# Altium project Artix Express UltraScale v2_2023-02-28T07_25_07_UTC.PrjPcb (part 5 of 7)

## Sheet FPGA Power.SchDoc
size A3; SheetNumber: 3; SheetTotal: 16
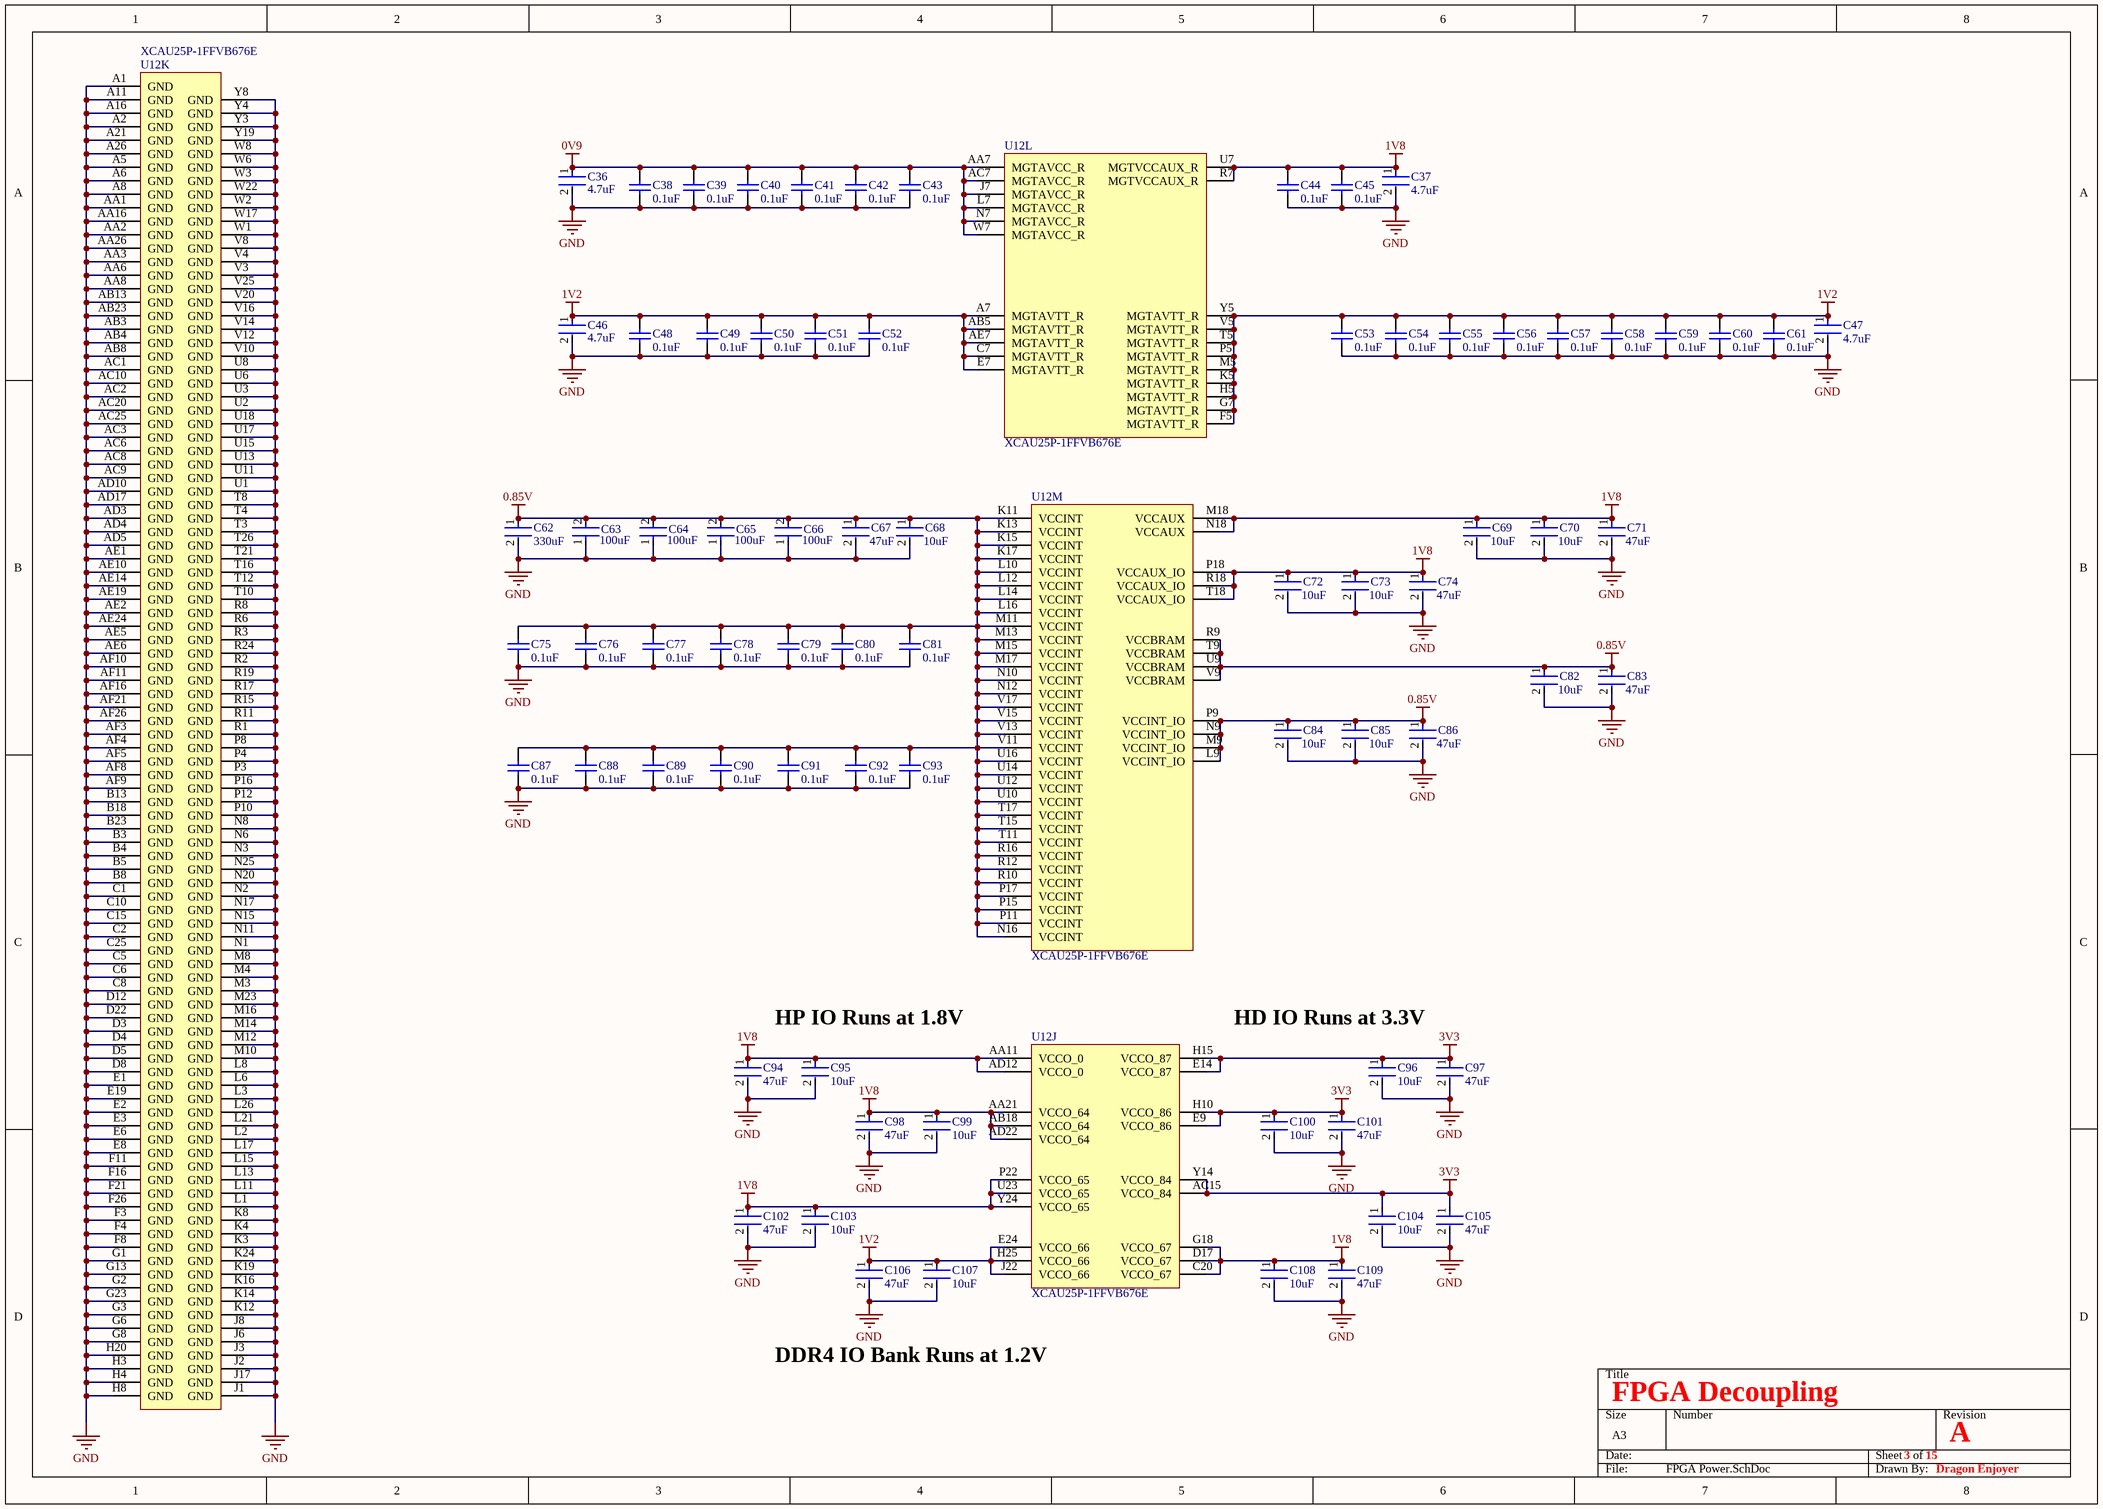
[diagram p13: FPGA Power.SchDoc]

### Parts
C36  Capacitance: 4.7uF  [FP-C1005-050-0_15-MFG]  (hidden comment: C1005X5R1A475K050BC)
C37  Capacitance: 4.7uF  [FP-C1005-050-0_15-MFG]  (hidden comment: C1005X5R1A475K050BC)
C38  value 0.1uF  [CAPC0603X33X15LL03T05]  (hidden comment: 02016D104KAT2A)
C39  value 0.1uF  [CAPC0603X33X15LL03T05]  (hidden comment: 02016D104KAT2A)
C40  value 0.1uF  [CAPC0603X33X15LL03T05]  (hidden comment: 02016D104KAT2A)
C41  value 0.1uF  [CAPC0603X33X15LL03T05]  (hidden comment: 02016D104KAT2A)
C42  value 0.1uF  [CAPC0603X33X15LL03T05]  (hidden comment: 02016D104KAT2A)
C43  value 0.1uF  [CAPC0603X33X15LL03T05]  (hidden comment: 02016D104KAT2A)
C44  value 0.1uF  [CAPC0603X33X15LL03T05]  (hidden comment: 02016D104KAT2A)
C45  value 0.1uF  [CAPC0603X33X15LL03T05]  (hidden comment: 02016D104KAT2A)
C46  Capacitance: 4.7uF  [FP-C1005-050-0_15-MFG]  (hidden comment: C1005X5R1A475K050BC)
C47  Capacitance: 4.7uF  [FP-C1005-050-0_15-MFG]  (hidden comment: C1005X5R1A475K050BC)
C48  value 0.1uF  [CAPC0603X33X15LL03T05]  (hidden comment: 02016D104KAT2A)
C49  value 0.1uF  [CAPC0603X33X15LL03T05]  (hidden comment: 02016D104KAT2A)
C50  value 0.1uF  [CAPC0603X33X15LL03T05]  (hidden comment: 02016D104KAT2A)
C51  value 0.1uF  [CAPC0603X33X15LL03T05]  (hidden comment: 02016D104KAT2A)
C52  value 0.1uF  [CAPC0603X33X15LL03T05]  (hidden comment: 02016D104KAT2A)
C53  value 0.1uF  [CAPC0603X33X15LL03T05]  (hidden comment: 02016D104KAT2A)
C54  value 0.1uF  [CAPC0603X33X15LL03T05]  (hidden comment: 02016D104KAT2A)
C55  value 0.1uF  [CAPC0603X33X15LL03T05]  (hidden comment: 02016D104KAT2A)
C56  value 0.1uF  [CAPC0603X33X15LL03T05]  (hidden comment: 02016D104KAT2A)
C57  value 0.1uF  [CAPC0603X33X15LL03T05]  (hidden comment: 02016D104KAT2A)
C58  value 0.1uF  [CAPC0603X33X15LL03T05]  (hidden comment: 02016D104KAT2A)
C59  value 0.1uF  [CAPC0603X33X15LL03T05]  (hidden comment: 02016D104KAT2A)
C60  value 0.1uF  [CAPC0603X33X15LL03T05]  (hidden comment: 02016D104KAT2A)
C61  value 0.1uF  [CAPC0603X33X15LL03T05]  (hidden comment: 02016D104KAT2A)
C62  Capacitance: 330uF  [FP-GRM32E-0_3-IPC_C]  (hidden comment: GRM32EC80E337ME05L)
C63  Capacitance: 100uF  [FP-GRM21B-0_2-e0_2_0_7-IPC_C]  (hidden comment: GRM21BC80G107ME15L)
C64  Capacitance: 100uF  [FP-GRM21B-0_2-e0_2_0_7-IPC_C]  (hidden comment: GRM21BC80G107ME15L)
C65  Capacitance: 100uF  [FP-GRM21B-0_2-e0_2_0_7-IPC_C]  (hidden comment: GRM21BC80G107ME15L)
C66  Capacitance: 100uF  [FP-GRM21B-0_2-e0_2_0_7-IPC_C]  (hidden comment: GRM21BC80G107ME15L)
C67  Capacitance: 47uF  [FP-GRM188-0_2-IPC_C]  (hidden comment: GRM188C80E476ME05D)
C68  Capacitance: 10uF  [FP-GRM15-0_2-MFG]  (hidden comment: GRM155C80J106ME11D)
C69  Capacitance: 10uF  [FP-GRM15-0_2-MFG]  (hidden comment: GRM155C80J106ME11D)
C70  Capacitance: 10uF  [FP-GRM15-0_2-MFG]  (hidden comment: GRM155C80J106ME11D)
C71  Capacitance: 47uF  [FP-GRM188-0_2-IPC_C]  (hidden comment: GRM188C80E476ME05D)
C72  Capacitance: 10uF  [FP-GRM15-0_2-MFG]  (hidden comment: GRM155C80J106ME11D)
C73  Capacitance: 10uF  [FP-GRM15-0_2-MFG]  (hidden comment: GRM155C80J106ME11D)
C74  Capacitance: 47uF  [FP-GRM188-0_2-IPC_C]  (hidden comment: GRM188C80E476ME05D)
C75  value 0.1uF  [CAPC0603X33X15LL03T05]  (hidden comment: 02016D104KAT2A)
C76  value 0.1uF  [CAPC0603X33X15LL03T05]  (hidden comment: 02016D104KAT2A)
C77  value 0.1uF  [CAPC0603X33X15LL03T05]  (hidden comment: 02016D104KAT2A)
C78  value 0.1uF  [CAPC0603X33X15LL03T05]  (hidden comment: 02016D104KAT2A)
C79  value 0.1uF  [CAPC0603X33X15LL03T05]  (hidden comment: 02016D104KAT2A)
C80  value 0.1uF  [CAPC0603X33X15LL03T05]  (hidden comment: 02016D104KAT2A)
C81  value 0.1uF  [CAPC0603X33X15LL03T05]  (hidden comment: 02016D104KAT2A)
C82  Capacitance: 10uF  [FP-GRM15-0_2-MFG]  (hidden comment: GRM155C80J106ME11D)
C83  Capacitance: 47uF  [FP-GRM188-0_2-IPC_C]  (hidden comment: GRM188C80E476ME05D)
C84  Capacitance: 10uF  [FP-GRM15-0_2-MFG]  (hidden comment: GRM155C80J106ME11D)
C85  Capacitance: 10uF  [FP-GRM15-0_2-MFG]  (hidden comment: GRM155C80J106ME11D)
C86  Capacitance: 47uF  [FP-GRM188-0_2-IPC_C]  (hidden comment: GRM188C80E476ME05D)
C87  value 0.1uF  [CAPC0603X33X15LL03T05]  (hidden comment: 02016D104KAT2A)
C88  value 0.1uF  [CAPC0603X33X15LL03T05]  (hidden comment: 02016D104KAT2A)
C89  value 0.1uF  [CAPC0603X33X15LL03T05]  (hidden comment: 02016D104KAT2A)
C90  value 0.1uF  [CAPC0603X33X15LL03T05]  (hidden comment: 02016D104KAT2A)
C91  value 0.1uF  [CAPC0603X33X15LL03T05]  (hidden comment: 02016D104KAT2A)
C92  value 0.1uF  [CAPC0603X33X15LL03T05]  (hidden comment: 02016D104KAT2A)
C93  value 0.1uF  [CAPC0603X33X15LL03T05]  (hidden comment: 02016D104KAT2A)
C94  Capacitance: 47uF  [FP-GRM188-0_2-IPC_C]  (hidden comment: GRM188C80E476ME05D)
C95  Capacitance: 10uF  [FP-GRM15-0_2-MFG]  (hidden comment: GRM155C80J106ME11D)
C96  Capacitance: 10uF  [FP-GRM15-0_2-MFG]  (hidden comment: GRM155C80J106ME11D)
C97  Capacitance: 47uF  [FP-GRM188-0_2-IPC_C]  (hidden comment: GRM188C80E476ME05D)
C98  Capacitance: 47uF  [FP-GRM188-0_2-IPC_C]  (hidden comment: GRM188C80E476ME05D)
C99  Capacitance: 10uF  [FP-GRM15-0_2-MFG]  (hidden comment: GRM155C80J106ME11D)
C100  Capacitance: 10uF  [FP-GRM15-0_2-MFG]  (hidden comment: GRM155C80J106ME11D)
C101  Capacitance: 47uF  [FP-GRM188-0_2-IPC_C]  (hidden comment: GRM188C80E476ME05D)
C102  Capacitance: 47uF  [FP-GRM188-0_2-IPC_C]  (hidden comment: GRM188C80E476ME05D)
C103  Capacitance: 10uF  [FP-GRM15-0_2-MFG]  (hidden comment: GRM155C80J106ME11D)
C104  Capacitance: 10uF  [FP-GRM15-0_2-MFG]  (hidden comment: GRM155C80J106ME11D)
C105  Capacitance: 47uF  [FP-GRM188-0_2-IPC_C]  (hidden comment: GRM188C80E476ME05D)
C106  Capacitance: 47uF  [FP-GRM188-0_2-IPC_C]  (hidden comment: GRM188C80E476ME05D)
C107  Capacitance: 10uF  [FP-GRM15-0_2-MFG]  (hidden comment: GRM155C80J106ME11D)
C108  Capacitance: 10uF  [FP-GRM15-0_2-MFG]  (hidden comment: GRM155C80J106ME11D)
C109  Capacitance: 47uF  [FP-GRM188-0_2-IPC_C]  (hidden comment: GRM188C80E476ME05D)
U12  XCAU25P-1FFVB676E  [BGA676C100P26X26_2600X2600X352]  (parts J,K,L,M of 14)

### Nets
0.85V: C62.1 C63.2 C64.2 C65.2 C66.2 C67.1 C68.1 C75.2 C76.2 C77.2 C78.2 C79.2 C80.2 C81.2 C82.1 C83.1 C84.1 C85.1 C86.1 C87.2 C88.2 C89.2 C90.2 C91.2 C92.2 C93.2 U12.K11(VCCINT) U12.K13(VCCINT) U12.K15(VCCINT) U12.K17(VCCINT) U12.L9(VCCINT_IO) U12.L10(VCCINT) U12.L12(VCCINT) U12.L14(VCCINT) U12.L16(VCCINT) U12.M9(VCCINT_IO) U12.M11(VCCINT) U12.M13(VCCINT) U12.M15(VCCINT) U12.M17(VCCINT) U12.N9(VCCINT_IO) U12.N10(VCCINT) U12.N12(VCCINT) U12.N16(VCCINT) U12.P9(VCCINT_IO) U12.P11(VCCINT) U12.P15(VCCINT) U12.P17(VCCINT) U12.R9(VCCBRAM) U12.R10(VCCINT) U12.R12(VCCINT) U12.R16(VCCINT) U12.T9(VCCBRAM) U12.T11(VCCINT) U12.T15(VCCINT) U12.T17(VCCINT) U12.U9(VCCBRAM) U12.U10(VCCINT) U12.U12(VCCINT) U12.U14(VCCINT) U12.U16(VCCINT) U12.V9(VCCBRAM) U12.V11(VCCINT) U12.V13(VCCINT) U12.V15(VCCINT) U12.V17(VCCINT)
0V9: C36.1 C38.2 C39.2 C40.2 C41.2 C42.2 C43.2 U12.AA7(MGTAVCC_R) U12.AC7(MGTAVCC_R) U12.J7(MGTAVCC_R) U12.L7(MGTAVCC_R) U12.N7(MGTAVCC_R) U12.W7(MGTAVCC_R)
1V2: C46.1 C47.1 C48.2 C49.2 C50.2 C51.2 C52.2 C53.2 C54.2 C55.2 C56.2 C57.2 C58.2 C59.2 C60.2 C61.2 C106.1 C107.1 U12.A7(MGTAVTT_R) U12.AB5(MGTAVTT_R) U12.AE7(MGTAVTT_R) U12.C7(MGTAVTT_R) U12.E7(MGTAVTT_R) U12.E24(VCCO_66) U12.F5(MGTAVTT_R) U12.G7(MGTAVTT_R) U12.H5(MGTAVTT_R) U12.H25(VCCO_66) U12.J22(VCCO_66) U12.K5(MGTAVTT_R) U12.M5(MGTAVTT_R) U12.P5(MGTAVTT_R) U12.T5(MGTAVTT_R) U12.V5(MGTAVTT_R) U12.Y5(MGTAVTT_R)
1V8: C37.1 C44.2 C45.2 C69.1 C70.1 C71.1 C72.1 C73.1 C74.1 C94.1 C95.1 C98.1 C99.1 C102.1 C103.1 C108.1 C109.1 U12.AA11(VCCO_0) U12.AA21(VCCO_64) U12.AB18(VCCO_64) U12.AD12(VCCO_0) U12.AD22(VCCO_64) U12.C20(VCCO_67) U12.D17(VCCO_67) U12.G18(VCCO_67) U12.M18(VCCAUX) U12.N18(VCCAUX) U12.P18(VCCAUX_IO) U12.P22(VCCO_65) U12.R7(MGTVCCAUX_R) U12.R18(VCCAUX_IO) U12.T18(VCCAUX_IO) U12.U7(MGTVCCAUX_R) U12.U23(VCCO_65) U12.Y24(VCCO_65)
3V3: C96.1 C97.1 C100.1 C101.1 C104.1 C105.1 U12.AC15(VCCO_84) U12.E9(VCCO_86) U12.E14(VCCO_87) U12.H10(VCCO_86) U12.H15(VCCO_87) U12.Y14(VCCO_84)  [project net +3V3]
GND: C36.2 C37.2 C38.1 C39.1 C40.1 C41.1 C42.1 C43.1 C44.1 C45.1 C46.2 C47.2 C48.1 C49.1 C50.1 C51.1 C52.1 C53.1 C54.1 C55.1 C56.1 C57.1 C58.1 C59.1 C60.1 C61.1 C62.2 C63.1 C64.1 C65.1 C66.1 C67.2 C68.2 C69.2 C70.2 C71.2 C72.2 C73.2 C74.2 C75.1 C76.1 C77.1 C78.1 C79.1 C80.1 C81.1 C82.2 C83.2 C84.2 C85.2 C86.2 C87.1 C88.1 C89.1 C90.1 C91.1 C92.1 C93.1 C94.2 C95.2 C96.2 C97.2 C98.2 C99.2 C100.2 C101.2 C102.2 C103.2 C104.2 C105.2 C106.2 C107.2 C108.2 C109.2 U12.A1(GND) U12.A2(GND) U12.A5(GND) U12.A6(GND) U12.A8(GND) U12.A11(GND) U12.A16(GND) U12.A21(GND) U12.A26(GND) U12.AA1(GND) U12.AA2(GND) U12.AA3(GND) U12.AA6(GND) U12.AA8(GND) U12.AA16(GND) U12.AA26(GND) U12.AB3(GND) U12.AB4(GND) U12.AB8(GND) U12.AB13(GND) U12.AB23(GND) U12.AC1(GND) U12.AC2(GND) U12.AC3(GND) U12.AC6(GND) U12.AC8(GND) U12.AC9(GND) U12.AC10(GND) U12.AC20(GND) U12.AC25(GND) U12.AD3(GND) U12.AD4(GND) U12.AD5(GND) U12.AD10(GND) U12.AD17(GND) U12.AE1(GND) U12.AE2(GND) U12.AE5(GND) U12.AE6(GND) U12.AE10(GND) U12.AE14(GND) U12.AE19(GND) U12.AE24(GND) U12.AF3(GND) U12.AF4(GND) U12.AF5(GND) U12.AF8(GND) U12.AF9(GND) U12.AF10(GND) U12.AF11(GND) U12.AF16(GND) U12.AF21(GND) U12.AF26(GND) U12.B3(GND) U12.B4(GND) U12.B5(GND) U12.B8(GND) U12.B13(GND) U12.B18(GND) U12.B23(GND) U12.C1(GND) U12.C2(GND) U12.C5(GND) U12.C6(GND) U12.C8(GND) U12.C10(GND) U12.C15(GND) U12.C25(GND) U12.D3(GND) U12.D4(GND) U12.D5(GND) U12.D8(GND) U12.D12(GND) U12.D22(GND) U12.E1(GND) U12.E2(GND) U12.E3(GND) U12.E6(GND) U12.E8(GND) U12.E19(GND) U12.F3(GND) U12.F4(GND) U12.F8(GND) U12.F11(GND) U12.F16(GND) U12.F21(GND) U12.F26(GND) U12.G1(GND) U12.G2(GND) U12.G3(GND) U12.G6(GND) U12.G8(GND) U12.G13(GND) U12.G23(GND) U12.H3(GND) U12.H4(GND) U12.H8(GND) U12.H20(GND) U12.J1(GND) U12.J2(GND) U12.J3(GND) U12.J6(GND) U12.J8(GND) U12.J17(GND) U12.K3(GND) U12.K4(GND) U12.K8(GND) U12.K12(GND) U12.K14(GND) U12.K16(GND) U12.K19(GND) U12.K24(GND) U12.L1(GND) U12.L2(GND) U12.L3(GND) U12.L6(GND) U12.L8(GND) U12.L11(GND) U12.L13(GND) U12.L15(GND) U12.L17(GND) U12.L21(GND) U12.L26(GND) U12.M3(GND) U12.M4(GND) U12.M8(GND) U12.M10(GND) U12.M12(GND) U12.M14(GND) U12.M16(GND) U12.M23(GND) U12.N1(GND) U12.N2(GND) U12.N3(GND) U12.N6(GND) U12.N8(GND) U12.N11(GND) U12.N15(GND) U12.N17(GND) U12.N20(GND) U12.N25(GND) U12.P3(GND) U12.P4(GND) U12.P8(GND) U12.P10(GND) U12.P12(GND) U12.P16(GND) U12.R1(GND) U12.R2(GND) U12.R3(GND) U12.R6(GND) U12.R8(GND) U12.R11(GND) U12.R15(GND) U12.R17(GND) U12.R19(GND) U12.R24(GND) U12.T3(GND) U12.T4(GND) U12.T8(GND) U12.T10(GND) U12.T12(GND) U12.T16(GND) U12.T21(GND) U12.T26(GND) U12.U1(GND) U12.U2(GND) U12.U3(GND) U12.U6(GND) U12.U8(GND) U12.U11(GND) U12.U13(GND) U12.U15(GND) U12.U17(GND) U12.U18(GND) U12.V3(GND) U12.V4(GND) U12.V8(GND) U12.V10(GND) U12.V12(GND) U12.V14(GND) U12.V16(GND) U12.V20(GND) U12.V25(GND) U12.W1(GND) U12.W2(GND) U12.W3(GND) U12.W6(GND) U12.W8(GND) U12.W17(GND) U12.W22(GND) U12.Y3(GND) U12.Y4(GND) U12.Y8(GND) U12.Y19(GND)

### Notes on the sheet
- HP IO Runs at 1.8V
- HD IO Runs at 3.3V
- DDR4 IO Bank Runs at 1.2V
- FPGA Decoupling
- 3
- 15
- A
- Dragon Enjoyer

### Library data of the parts
C36 C37 C46 C47 = CMP-2000-05997-2: CAP CER 4.7UF 10V X5R 0402; Dielectric Material: Ceramic; Tolerance: 10%; Series: C; Package Quantity: 10000; Max Operating Temperature: 85°C; Case Code (Imperial): 0402; Lead Free: Lead Free; Voltage Rating (DC): 10V; Packaging: Cut Tape; Voltage Rating: 10V; Min Operating Temperature: -55°C; Dielectric: X5R; Thickness: 0.022inch; Width: 0.02inch; Case/Package: 0402; Case Code (Metric): 1005; Length: 0.039inch; RoHS Compliant: Yes; REACH SVHC: No SVHC; Mount: Surface Mount
C38-C45 C48-C61 C75-C81 C87-C93 = CMP-2010-00159-1: Manufacturer: AVX Interconnect / Elco; Part Number: 02016D104KAT2A
C62 = CMP-06035-049468-1: Chip Multilayer Ceramic Capacitors for General Purpose, 1210, 330uF, X6S, 22%, 20%, 2.5V; Tolerance: 20%; Packaging: Tape and Reel; Mount: Surface Mount; Max Operating Temperature: 105°C; Min Operating Temperature: -55°C; Case Code (Imperial): 1210; Length: 0.126inch; Voltage Rating (DC): 2.5V; Dielectric: X6S; Thickness: 0.11inch; Case Code (Metric): 3225; Width: 0.098inch; Voltage Rating: 2.5V; Case/Package: 1210
C63-C66 = CMP-06035-010229-1: Chip Multilayer Ceramic Capacitors for General Purpose, 0805, 100uF, X6S, 22%, 20%, 4V; Case/Package: 0805; Packaging: Cut Tape; REACH SVHC: No SVHC; Min Operating Temperature: -55°C; Length: 0.079inch; Max Operating Temperature: 105°C; Case Code (Imperial): 0805; Width: 0.049inch; Case Code (Metric): 2012; Tolerance: 20%; Voltage Rating: 4V; Mount: Surface Mount; Voltage Rating (DC): 4V; Thickness: 0.057inch; Dielectric: X6S
C67 C71 C74 C83 C86 C94 C97 C98 C101 C102 C105 C106 C109 = CMP-06035-059951-1: Chip Multilayer Ceramic Capacitors for General Purpose, 0603, 47uF, X6S, 22%, 20%, 2.5V; Min Operating Temperature: -55°C; Length: 0.063inch; Thickness: 0.039inch; Tolerance: 20%; Width: 0.031inch; Case Code (Metric): 1608; Voltage Rating: 2.5V; Voltage Rating (DC): 2.5V; Case Code (Imperial): 0603; Dielectric: X6S; Mount: Surface Mount; Case/Package: 0603; Max Operating Temperature: 105°C; Packaging: Tape and Reel
C68-C70 C72 C73 C82 C84 C85 C95 C96 C99 C100 C103 C104 C107 C108 = CMP-06035-000074-1: CAP CER 10UF 6.3V X6S 0402; Manufacturer: Murata; Tolerance: 20%; Material: Ceramic; Temperature Coefficient: 22%; ComponentLink2Description: Datasheet; Temperature Characteristic: X6S; RoHS: TRUE; Value: 10uF; Temperature: -55°C to +105°C; Device Class L2: Capacitors; Height: 0.7mm; Category: Cap; Manufacturer Part Number: GRM155C80J106ME11D; Device Class L1: Passive Components; Temperature Range Low: -55°C; Automotive: No; Mouser Description: Cap Ceramic 10uF 6.3V X6S 20% Pad SMD 0402 105C T/R; ComponentLink2URL: https://search.murata.co.jp/Ceramy/image/img/A01X/G101/ENG/GRM155C80J106ME11-01.pdf; Voltage Rating: 6.3V; Ipc Land Pattern Name: CAPC10050X50; Lead Free: Yes; Octopart: https://octopart.com/grm155c80j106me11d-murata-71220993; Digikey Description: CAP CER 10UF 6.3V X6S 0402; Temperature Range High: +105°C; Package: GRM15-0.2; Device Class L3: Ceramic Capacitors
U12 = CMP-020-00023-3: FPGA XCAU25 Family 308437 Logic Units 308437 Cells 0.85V 676-Pin FCBGA

## Sheet FPGA Transcievers.SchDoc
size A3; SheetNumber: 6; SheetTotal: 16
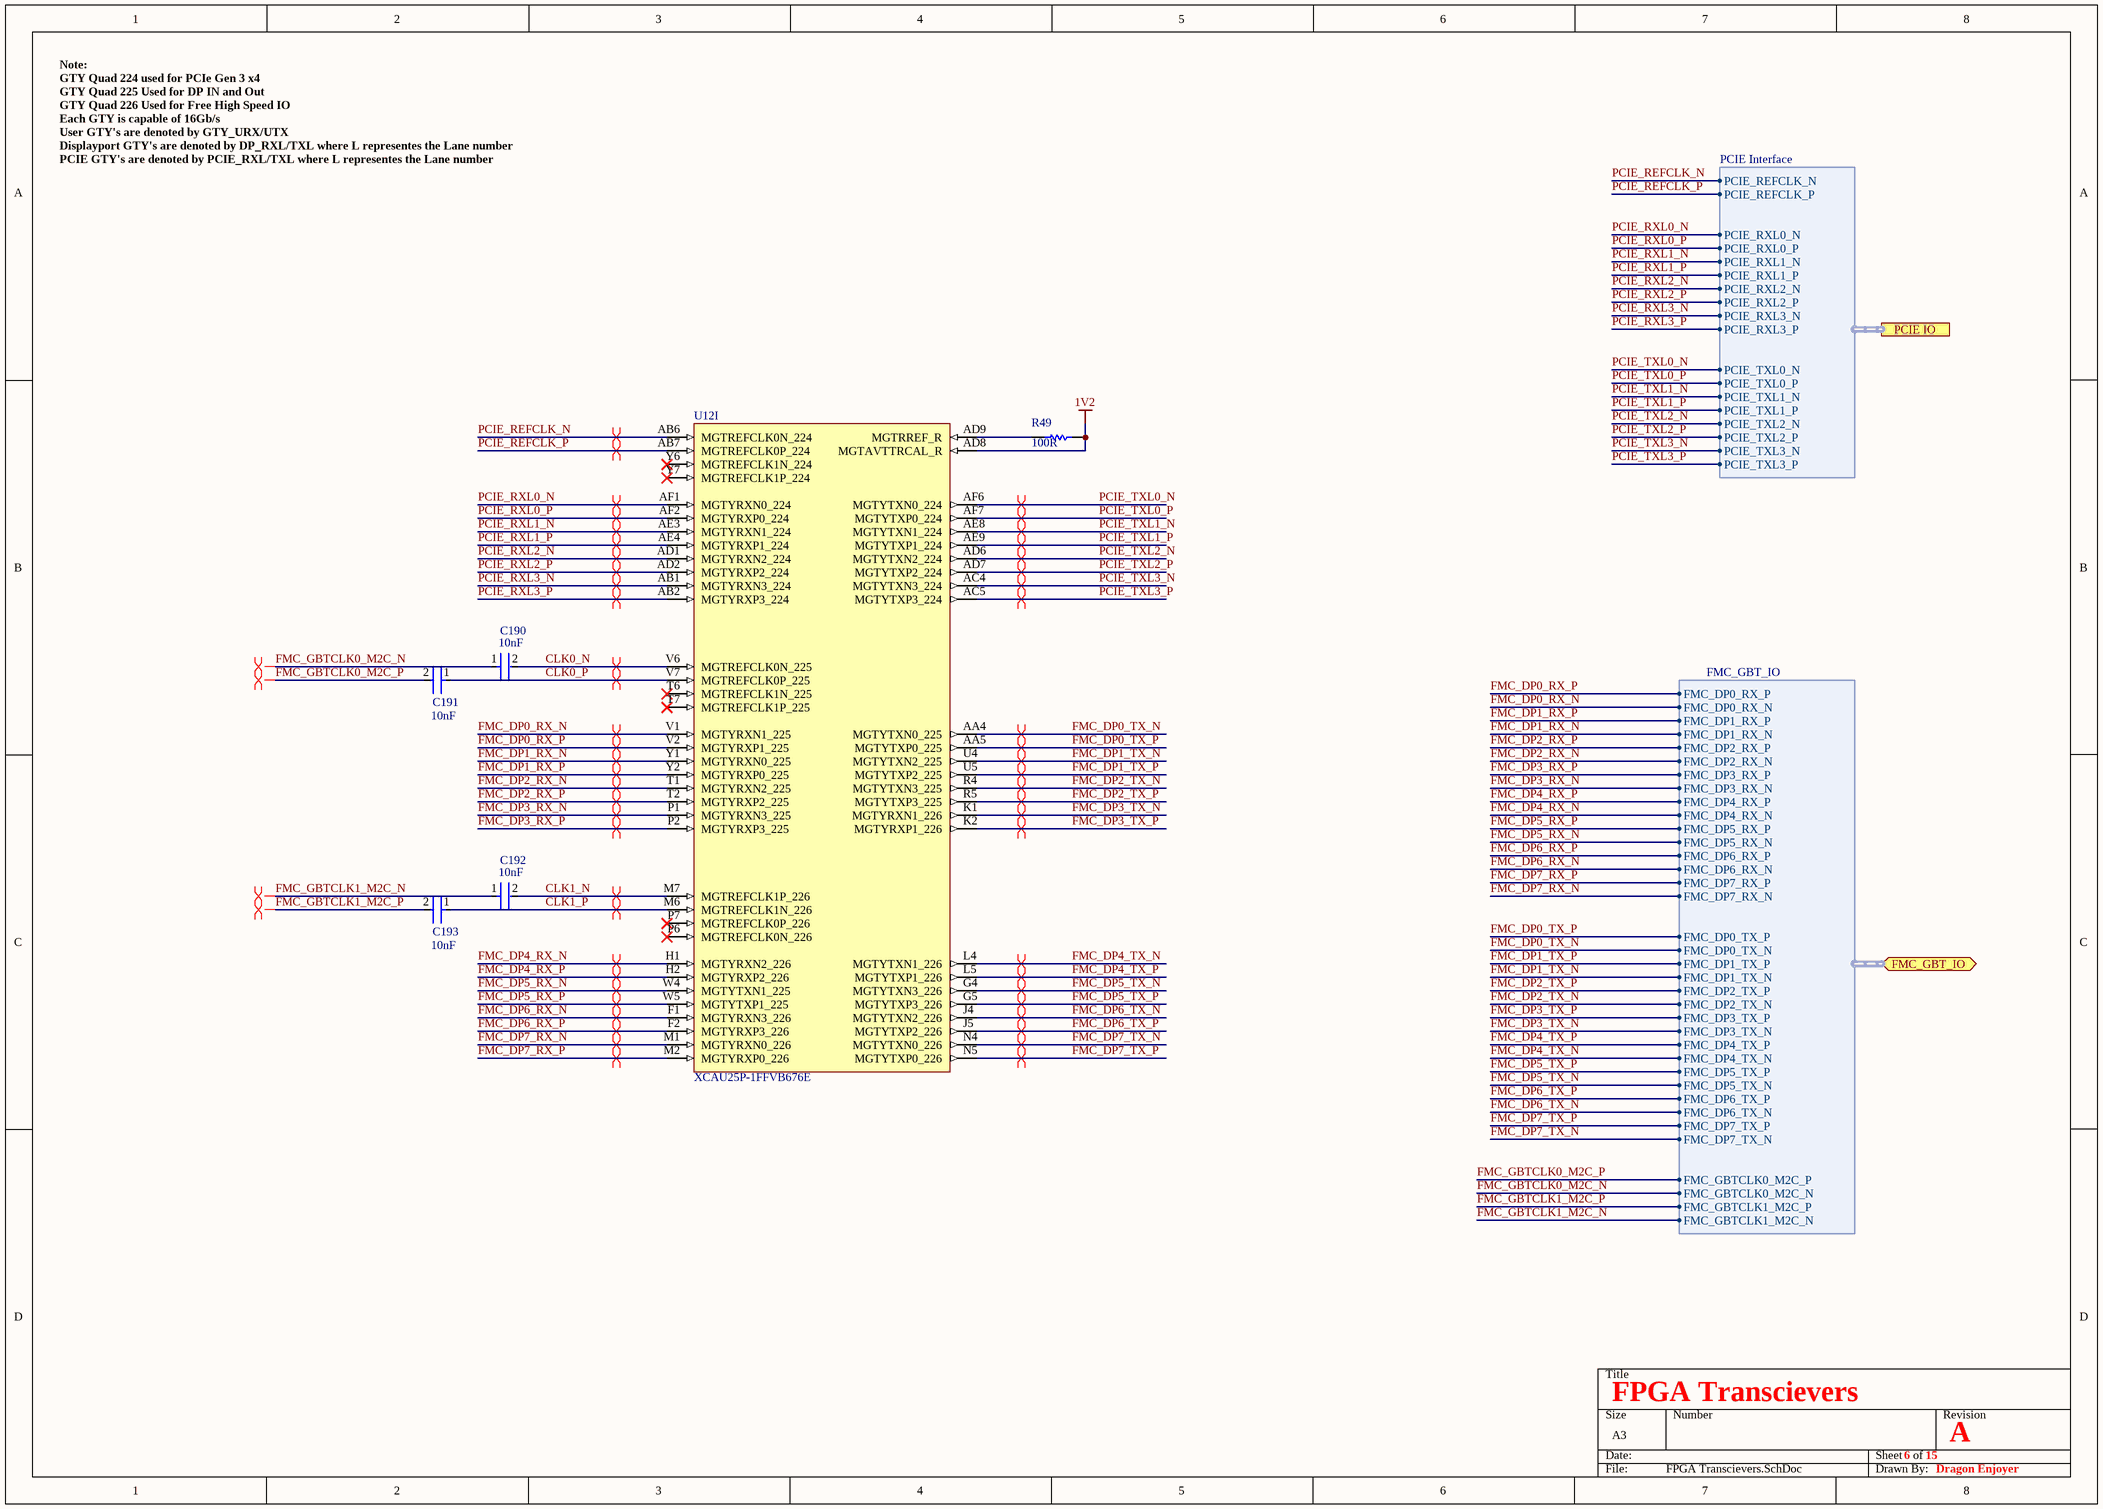
[diagram p14: FPGA Transcievers.SchDoc]

### Parts
C190  Capacitance: 10nF  [FP-GRM155-0_05-IPC_C]  (hidden comment: GRM155R71H103KA88D)
C191  Capacitance: 10nF  [FP-GRM155-0_05-IPC_C]  (hidden comment: GRM155R71H103KA88D)
C192  Capacitance: 10nF  [FP-GRM155-0_05-IPC_C]  (hidden comment: GRM155R71H103KA88D)
C193  Capacitance: 10nF  [FP-GRM155-0_05-IPC_C]  (hidden comment: GRM155R71H103KA88D)
R49  value 100R  [RESC1005X40X25ML05T10]  (hidden comment: RC0402FR-07100RL)
U12  XCAU25P-1FFVB676E  [BGA676C100P26X26_2600X2600X352]  (part I of 14)

### Ports
FMC_GBT_IO (bidir, harness FMC_GBT_IO), PCIE IO (harness PCIE Interface)

### Harnesses
PCIE Interface: PCIE_REFCLK_N, PCIE_REFCLK_P, PCIE_RXL0_N, PCIE_RXL0_P, PCIE_RXL1_N, PCIE_RXL1_P, PCIE_RXL2_N, PCIE_RXL2_P, PCIE_RXL3_N, PCIE_RXL3_P, PCIE_TXL0_N, PCIE_TXL0_P, PCIE_TXL1_N, PCIE_TXL1_P, PCIE_TXL2_N, PCIE_TXL2_P, PCIE_TXL3_N, PCIE_TXL3_P
FMC_GBT_IO: FMC_DP0_RX_P, FMC_DP0_RX_N, FMC_DP1_RX_P, FMC_DP1_RX_N, FMC_DP2_RX_P, FMC_DP2_RX_N, FMC_DP3_RX_P, FMC_DP3_RX_N, FMC_DP4_RX_P, FMC_DP4_RX_N, FMC_DP5_RX_P, FMC_DP5_RX_N, FMC_DP6_RX_P, FMC_DP6_RX_N, FMC_DP7_RX_P, FMC_DP7_RX_N, FMC_DP0_TX_P, FMC_DP0_TX_N, FMC_DP1_TX_P, FMC_DP1_TX_N, FMC_DP2_TX_P, FMC_DP2_TX_N, FMC_DP3_TX_P, FMC_DP3_TX_N, FMC_DP4_TX_P, FMC_DP4_TX_N, FMC_DP5_TX_P, FMC_DP5_TX_N, FMC_DP6_TX_P, FMC_DP6_TX_N, FMC_DP7_TX_P, FMC_DP7_TX_N, FMC_GBTCLK0_M2C_P, FMC_GBTCLK0_M2C_N, FMC_GBTCLK1_M2C_P, FMC_GBTCLK1_M2C_N

### Nets
1V2: R49.2 U12.AD8(MGTAVTTRCAL_R)
CLK0_N: C190.2 U12.V6(MGTREFCLK0N_225)
CLK0_P: C191.1 U12.V7(MGTREFCLK0P_225)
CLK1_N: C192.2 U12.M7(MGTREFCLK1P_226)
CLK1_P: C193.1 U12.M6(MGTREFCLK1N_226)
FMC_DP0_RX_N: U12.V1(MGTYRXN1_225) ; port FMC_GBT_IO.FMC_DP0_RX_N
FMC_DP0_RX_P: U12.V2(MGTYRXP1_225) ; port FMC_GBT_IO.FMC_DP0_RX_P
FMC_DP0_TX_N: U12.AA4(MGTYTXN0_225) ; port FMC_GBT_IO.FMC_DP0_TX_N
FMC_DP0_TX_P: U12.AA5(MGTYTXP0_225) ; port FMC_GBT_IO.FMC_DP0_TX_P
FMC_DP1_RX_N: U12.Y1(MGTYRXN0_225) ; port FMC_GBT_IO.FMC_DP1_RX_N
FMC_DP1_RX_P: U12.Y2(MGTYRXP0_225) ; port FMC_GBT_IO.FMC_DP1_RX_P
FMC_DP1_TX_N: U12.U4(MGTYTXN2_225) ; port FMC_GBT_IO.FMC_DP1_TX_N
FMC_DP1_TX_P: U12.U5(MGTYTXP2_225) ; port FMC_GBT_IO.FMC_DP1_TX_P
FMC_DP2_RX_N: U12.T1(MGTYRXN2_225) ; port FMC_GBT_IO.FMC_DP2_RX_N
FMC_DP2_RX_P: U12.T2(MGTYRXP2_225) ; port FMC_GBT_IO.FMC_DP2_RX_P
FMC_DP2_TX_N: U12.R4(MGTYTXN3_225) ; port FMC_GBT_IO.FMC_DP2_TX_N
FMC_DP2_TX_P: U12.R5(MGTYTXP3_225) ; port FMC_GBT_IO.FMC_DP2_TX_P
FMC_DP3_RX_N: U12.P1(MGTYRXN3_225) ; port FMC_GBT_IO.FMC_DP3_RX_N
FMC_DP3_RX_P: U12.P2(MGTYRXP3_225) ; port FMC_GBT_IO.FMC_DP3_RX_P
FMC_DP3_TX_N: U12.K1(MGTYRXN1_226) ; port FMC_GBT_IO.FMC_DP3_TX_N
FMC_DP3_TX_P: U12.K2(MGTYRXP1_226) ; port FMC_GBT_IO.FMC_DP3_TX_P
FMC_DP4_RX_N: U12.H1(MGTYRXN2_226) ; port FMC_GBT_IO.FMC_DP4_RX_N
FMC_DP4_RX_P: U12.H2(MGTYRXP2_226) ; port FMC_GBT_IO.FMC_DP4_RX_P
FMC_DP4_TX_N: U12.L4(MGTYTXN1_226) ; port FMC_GBT_IO.FMC_DP4_TX_N
FMC_DP4_TX_P: U12.L5(MGTYTXP1_226) ; port FMC_GBT_IO.FMC_DP4_TX_P
FMC_DP5_RX_N: U12.W4(MGTYTXN1_225) ; port FMC_GBT_IO.FMC_DP5_RX_N
FMC_DP5_RX_P: U12.W5(MGTYTXP1_225) ; port FMC_GBT_IO.FMC_DP5_RX_P
FMC_DP5_TX_N: U12.G4(MGTYTXN3_226) ; port FMC_GBT_IO.FMC_DP5_TX_N
FMC_DP5_TX_P: U12.G5(MGTYTXP3_226) ; port FMC_GBT_IO.FMC_DP5_TX_P
FMC_DP6_RX_N: U12.F1(MGTYRXN3_226) ; port FMC_GBT_IO.FMC_DP6_RX_N
FMC_DP6_RX_P: U12.F2(MGTYRXP3_226) ; port FMC_GBT_IO.FMC_DP6_RX_P
FMC_DP6_TX_N: U12.J4(MGTYTXN2_226) ; port FMC_GBT_IO.FMC_DP6_TX_N
FMC_DP6_TX_P: U12.J5(MGTYTXP2_226) ; port FMC_GBT_IO.FMC_DP6_TX_P
FMC_DP7_RX_N: U12.M1(MGTYRXN0_226) ; port FMC_GBT_IO.FMC_DP7_RX_N
FMC_DP7_RX_P: U12.M2(MGTYRXP0_226) ; port FMC_GBT_IO.FMC_DP7_RX_P
FMC_DP7_TX_N: U12.N4(MGTYTXN0_226) ; port FMC_GBT_IO.FMC_DP7_TX_N
FMC_DP7_TX_P: U12.N5(MGTYTXP0_226) ; port FMC_GBT_IO.FMC_DP7_TX_P
FMC_GBTCLK0_M2C_N: C190.1 ; port FMC_GBT_IO.FMC_GBTCLK0_M2C_N
FMC_GBTCLK0_M2C_P: C191.2 ; port FMC_GBT_IO.FMC_GBTCLK0_M2C_P
FMC_GBTCLK1_M2C_N: C192.1 ; port FMC_GBT_IO.FMC_GBTCLK1_M2C_N
FMC_GBTCLK1_M2C_P: C193.2 ; port FMC_GBT_IO.FMC_GBTCLK1_M2C_P
PCIE_REFCLK_N: U12.AB6(MGTREFCLK0N_224) ; port PCIE IO.PCIE_REFCLK_N
PCIE_REFCLK_P: U12.AB7(MGTREFCLK0P_224) ; port PCIE IO.PCIE_REFCLK_P
PCIE_RXL0_N: U12.AF1(MGTYRXN0_224) ; port PCIE IO.PCIE_RXL0_N
PCIE_RXL0_P: U12.AF2(MGTYRXP0_224) ; port PCIE IO.PCIE_RXL0_P
PCIE_RXL1_N: U12.AE3(MGTYRXN1_224) ; port PCIE IO.PCIE_RXL1_N
PCIE_RXL1_P: U12.AE4(MGTYRXP1_224) ; port PCIE IO.PCIE_RXL1_P
PCIE_RXL2_N: U12.AD1(MGTYRXN2_224) ; port PCIE IO.PCIE_RXL2_N
PCIE_RXL2_P: U12.AD2(MGTYRXP2_224) ; port PCIE IO.PCIE_RXL2_P
PCIE_RXL3_N: U12.AB1(MGTYRXN3_224) ; port PCIE IO.PCIE_RXL3_N
PCIE_RXL3_P: U12.AB2(MGTYRXP3_224) ; port PCIE IO.PCIE_RXL3_P
PCIE_TXL0_N: U12.AF6(MGTYTXN0_224) ; port PCIE IO.PCIE_TXL0_N
PCIE_TXL0_P: U12.AF7(MGTYTXP0_224) ; port PCIE IO.PCIE_TXL0_P
PCIE_TXL1_N: U12.AE8(MGTYTXN1_224) ; port PCIE IO.PCIE_TXL1_N
PCIE_TXL1_P: U12.AE9(MGTYTXP1_224) ; port PCIE IO.PCIE_TXL1_P
PCIE_TXL2_N: U12.AD6(MGTYTXN2_224) ; port PCIE IO.PCIE_TXL2_N
PCIE_TXL2_P: U12.AD7(MGTYTXP2_224) ; port PCIE IO.PCIE_TXL2_P
PCIE_TXL3_N: U12.AC4(MGTYTXN3_224) ; port PCIE IO.PCIE_TXL3_N
PCIE_TXL3_P: U12.AC5(MGTYTXP3_224) ; port PCIE IO.PCIE_TXL3_P
NetR49_1: R49.1 U12.AD9(MGTRREF_R)

Not connected (* = marked no-connect by the designer): U12 P6(MGTREFCLK0N_226)* P7(MGTREFCLK0P_226)* T6(MGTREFCLK1N_225)* T7(MGTREFCLK1P_225)* Y6(MGTREFCLK1N_224)* Y7(MGTREFCLK1P_224)*

### Layout directives
differential pair: CLK0_N, CLK0_P, CLK1_N, CLK1_P, FMC_DP0_RX_N, FMC_DP0_RX_P, FMC_DP0_TX_N, FMC_DP0_TX_P, FMC_DP1_RX_N, FMC_DP1_RX_P, FMC_DP1_TX_N, FMC_DP1_TX_P, FMC_DP2_RX_N, FMC_DP2_RX_P, FMC_DP2_TX_N, FMC_DP2_TX_P, FMC_DP3_RX_N, FMC_DP3_RX_P, FMC_DP3_TX_N, FMC_DP3_TX_P, FMC_DP4_RX_N, FMC_DP4_RX_P, FMC_DP4_TX_N, FMC_DP4_TX_P, FMC_DP5_RX_N, FMC_DP5_RX_P, FMC_DP5_TX_N, FMC_DP5_TX_P, FMC_DP6_RX_N, FMC_DP6_RX_P, FMC_DP6_TX_N, FMC_DP6_TX_P, FMC_DP7_RX_N, FMC_DP7_RX_P, FMC_DP7_TX_N, FMC_DP7_TX_P, FMC_GBTCLK0_M2C_N, FMC_GBTCLK0_M2C_P, FMC_GBTCLK1_M2C_N, FMC_GBTCLK1_M2C_P, PCIE_REFCLK_N, PCIE_REFCLK_P, PCIE_RXL0_N, PCIE_RXL0_P, PCIE_RXL1_N, PCIE_RXL1_P, PCIE_RXL2_N, PCIE_RXL2_P, PCIE_RXL3_N, PCIE_RXL3_P, PCIE_TXL0_N, PCIE_TXL0_P, PCIE_TXL1_N, PCIE_TXL1_P, PCIE_TXL2_N, PCIE_TXL2_P, PCIE_TXL3_N, PCIE_TXL3_P

### Notes on the sheet
- Note:
- GTY Quad 224 used for PCIe Gen 3 x4
- GTY Quad 225 Used for DP IN and Out
- GTY Quad 226 Used for Free High Speed IO
- Each GTY is capable of 16Gb/s
- User GTY's are denoted by GTY_URX/UTX
- Displayport GTY's are denoted by DP_RXL/TXL where L representes the Lane number
- PCIE GTY's are denoted by PCIE_RXL/TXL where L representes the Lane number
- FPGA Transcievers
- 6
- 15
- A
- Dragon Enjoyer

### Library data of the parts
C190-C193 = CMP-2008-04637-5: Chip Multilayer Ceramic Capacitors for General Purpose, 0402, 10000pF, X7R, 15%, 10%, 50V; Voltage: 25V; Tolerance: 10%; Mount: Surface Mount; Lead Free: Lead Free; Radiation Hardening: No; Case Code (Imperial): 0402; REACH SVHC: No SVHC; Case/Package: 0402; Dielectric: X7R; Voltage Rating (DC): 50V; Max Operating Temperature: 125°C; Termination: SMD/SMT; Material: Ceramic; Width: 0.02inch; Package Quantity: 1; Voltage Rating: 50V; Thickness: 0.022inch; Packaging: Tape and Reel; Height: 0.5mm; Number of Pins: 2; Case Code (Metric): 1005; Min Operating Temperature: -55°C; Length: 1mm; Depth: 0.5mm
R49 = CMP-2002-07344-1: Manufacturer: Yageo / Phycomp; Part Number: RC0402FR-07100RL
U12 = CMP-020-00023-3: as U12 on sheet FPGA Power

## Sheet LEDs.SchDoc
size A4; SheetNumber: 12; SheetTotal: 16
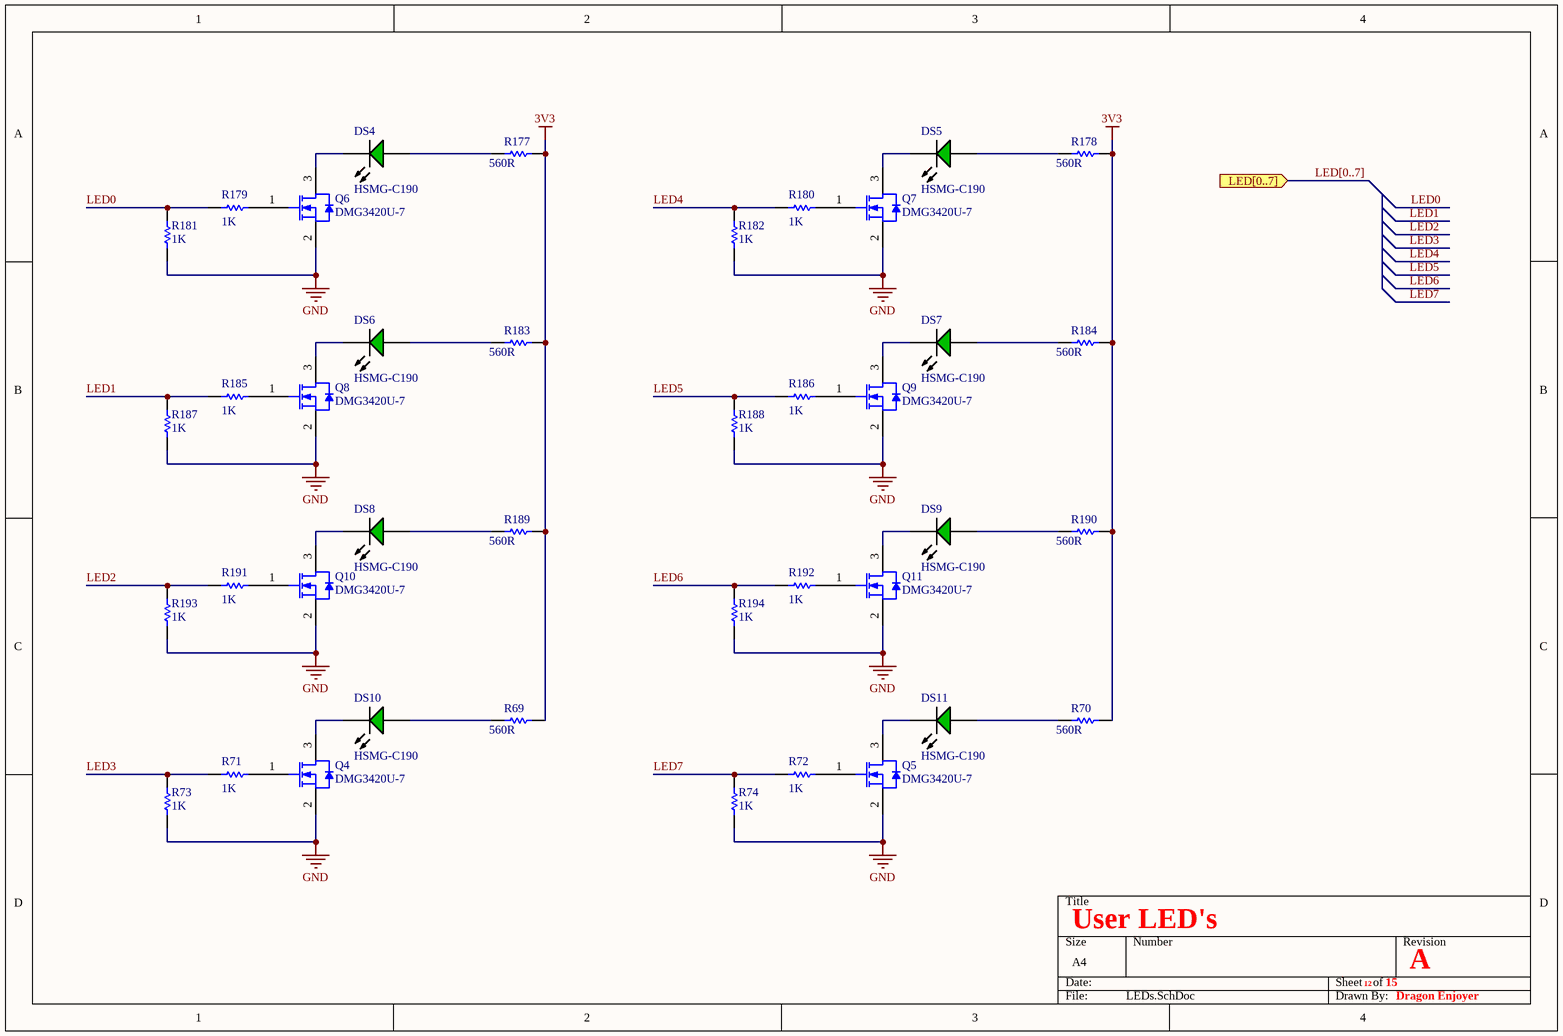
[diagram p15: LEDs.SchDoc]

### Parts
DS4  HSMG-C190  [AVAG-HSMX-C190_V]
DS5  HSMG-C190  [AVAG-HSMX-C190_V]
DS6  HSMG-C190  [AVAG-HSMX-C190_V]
DS7  HSMG-C190  [AVAG-HSMX-C190_V]
DS8  HSMG-C190  [AVAG-HSMX-C190_V]
DS9  HSMG-C190  [AVAG-HSMX-C190_V]
DS10  HSMG-C190  [AVAG-HSMX-C190_V]
DS11  HSMG-C190  [AVAG-HSMX-C190_V]
Q4  DMG3420U-7  [DIOD-SOT23-3_B_V]
Q5  DMG3420U-7  [DIOD-SOT23-3_B_V]
Q6  DMG3420U-7  [DIOD-SOT23-3_B_V]
Q7  DMG3420U-7  [DIOD-SOT23-3_B_V]
Q8  DMG3420U-7  [DIOD-SOT23-3_B_V]
Q9  DMG3420U-7  [DIOD-SOT23-3_B_V]
Q10  DMG3420U-7  [DIOD-SOT23-3_B_V]
Q11  DMG3420U-7  [DIOD-SOT23-3_B_V]
R69  value 560R  [RESC1608X55X30LL20T20]  (hidden comment: ERA3AEB561V)
R70  value 560R  [RESC1608X55X30LL20T20]  (hidden comment: ERA3AEB561V)
R71  value 1K  [RESC1005X40X25NL05T10]  (hidden comment: RC0402FR-071KL)
R72  value 1K  [RESC1005X40X25NL05T10]  (hidden comment: RC0402FR-071KL)
R73  value 1K  [RESC1005X40X25NL05T10]  (hidden comment: RC0402FR-071KL)
R74  value 1K  [RESC1005X40X25NL05T10]  (hidden comment: RC0402FR-071KL)
R177  value 560R  [RESC1608X55X30LL20T20]  (hidden comment: ERA3AEB561V)
R178  value 560R  [RESC1608X55X30LL20T20]  (hidden comment: ERA3AEB561V)
R179  value 1K  [RESC1005X40X25NL05T10]  (hidden comment: RC0402FR-071KL)
R180  value 1K  [RESC1005X40X25NL05T10]  (hidden comment: RC0402FR-071KL)
R181  value 1K  [RESC1005X40X25NL05T10]  (hidden comment: RC0402FR-071KL)
R182  value 1K  [RESC1005X40X25NL05T10]  (hidden comment: RC0402FR-071KL)
R183  value 560R  [RESC1608X55X30LL20T20]  (hidden comment: ERA3AEB561V)
R184  value 560R  [RESC1608X55X30LL20T20]  (hidden comment: ERA3AEB561V)
R185  value 1K  [RESC1005X40X25NL05T10]  (hidden comment: RC0402FR-071KL)
R186  value 1K  [RESC1005X40X25NL05T10]  (hidden comment: RC0402FR-071KL)
R187  value 1K  [RESC1005X40X25NL05T10]  (hidden comment: RC0402FR-071KL)
R188  value 1K  [RESC1005X40X25NL05T10]  (hidden comment: RC0402FR-071KL)
R189  value 560R  [RESC1608X55X30LL20T20]  (hidden comment: ERA3AEB561V)
R190  value 560R  [RESC1608X55X30LL20T20]  (hidden comment: ERA3AEB561V)
R191  value 1K  [RESC1005X40X25NL05T10]  (hidden comment: RC0402FR-071KL)
R192  value 1K  [RESC1005X40X25NL05T10]  (hidden comment: RC0402FR-071KL)
R193  value 1K  [RESC1005X40X25NL05T10]  (hidden comment: RC0402FR-071KL)
R194  value 1K  [RESC1005X40X25NL05T10]  (hidden comment: RC0402FR-071KL)

### Ports
LED[0..7] (in)

### Nets
3V3: R69.2 R70.2 R177.2 R178.2 R183.2 R184.2 R189.2 R190.2  [project net +3V3]
GND: Q4.2(S) Q5.2(S) Q6.2(S) Q7.2(S) Q8.2(S) Q9.2(S) Q10.2(S) Q11.2(S) R73.1 R74.1 R181.1 R182.1 R187.1 R188.1 R193.1 R194.1
LED0: R179.1 R181.2
LED1: R185.1 R187.2
LED2: R191.1 R193.2
LED3: R71.1 R73.2
LED4: R180.1 R182.2
LED5: R186.1 R188.2
LED6: R192.1 R194.2
LED7: R72.1 R74.2
NetDS4_1: DS4.1(A) R177.1
NetDS4_2: DS4.2(K) Q6.3(D)
NetDS5_1: DS5.1(A) R178.1
NetDS5_2: DS5.2(K) Q7.3(D)
NetDS6_1: DS6.1(A) R183.1
NetDS6_2: DS6.2(K) Q8.3(D)
NetDS7_1: DS7.1(A) R184.1
NetDS7_2: DS7.2(K) Q9.3(D)
NetDS8_1: DS8.1(A) R189.1
NetDS8_2: DS8.2(K) Q10.3(D)
NetDS9_1: DS9.1(A) R190.1
NetDS9_2: DS9.2(K) Q11.3(D)
NetDS10_1: DS10.1(A) R69.1
NetDS10_2: DS10.2(K) Q4.3(D)
NetDS11_1: DS11.1(A) R70.1
NetDS11_2: DS11.2(K) Q5.3(D)
NetQ4_1: Q4.1(G) R71.2
NetQ5_1: Q5.1(G) R72.2
NetQ6_1: Q6.1(G) R179.2
NetQ7_1: Q7.1(G) R180.2
NetQ8_1: Q8.1(G) R185.2
NetQ9_1: Q9.1(G) R186.2
NetQ10_1: Q10.1(G) R191.2
NetQ11_1: Q11.1(G) R192.2

### Buses and harness runs
bus LED[0..7] = port LED[0..7]

### Notes on the sheet
- User LED's
- 12
- 15
- A
- Dragon Enjoyer

### Library data of the parts
DS4-DS11 = CMP-1744-00002-1: Chip LED, Green, 2.2 V, -40 to 85 degC, 2-Pin SMD, RoHS, Tape and Reel; Frequency: 400 KHz; Max Supply Voltage: 5.5 V; Access Time: 3500 ns; Clock Frequency: 100 KHz; Case\Package: SOIC; Density: 32 kb; Nominal Supply Current: 2 mA; Interface: Serial; Min Supply Voltage: 1.7 V; Packaging: Tape and Reel; PackageReference: HSMX-C190; ComponentLink2URL: http://docs.avagotech.com/docs/AV02-0551EN; RoHSCompliant: true; Pins: 8; REACH SVHC: No SVHC; Max Operating Temperature: 85 degC; Width: 4 mm; Radiation Hardening: No; Package Quantity: 3000; ComponentLink3Description: Package Specification; ComponentLink1Description: Manufacturer URL; Min Operating Temperature: -40 degC; PackageDescription: 2-Pin Surface Mount Device, Body 1.6 x 0.8 mm, Height 0.9 mm; Max Clock Frequency: 100 KHz; Height: 1.5 mm; ComponentLink1URL: http://www.avagotech.com/; DatasheetVersion: Mar-12; ComponentLink2Description: Datasheet; Mount: Surface Mount; Length: 5 mm; ComponentLink3URL: http://www.fairchildsemi.com/dwg/MA/MA03D.pdf
Q4-Q11 = CMP-2000-06172-1: N-Channel Enhancement Mode MOSFET, 20 V, -55 to 150 degC, 3-Pin SOT23, RoHS, Tape and Reel; Manufacturer: Diodes Inc; Drain-Source On Resistance-Max: 29mO; Qg Gate Charge: 5.4nC; Drain-to-Source Voltage [Vdss]: 20V; Rated Power Dissipation: 740mW; Datasheet URL: http://www.diodes.com/_files/datasheets/ds31867.pdf; Package Description: 3-Pin Small Outline Transistor, Body 2.9 x 1.3 mm, Pitch 0.96 mm; Package Reference: SOT23-3; Datasheet Version: Rev. 5-2, 09/2013; Mounting Technology: SurfaceMount; Channel Type: N-Channel; Manufacturer URL: http://www.diodes.com/
R69 R70 R177 R178 R183 R184 R189 R190 = CMP-2000-00091-1: Manufacturer: Panasonic; Part Number: ERA3AEB561V
R71-R74 R179-R182 R185-R188 R191-R194 = CMP-2002-07472-1: Manufacturer: Yageo / Phycomp; Part Number: RC0402FR-071KL

## Sheet Power Supplies.SchDoc
size A2; SheetNumber: 2; SheetTotal: 16
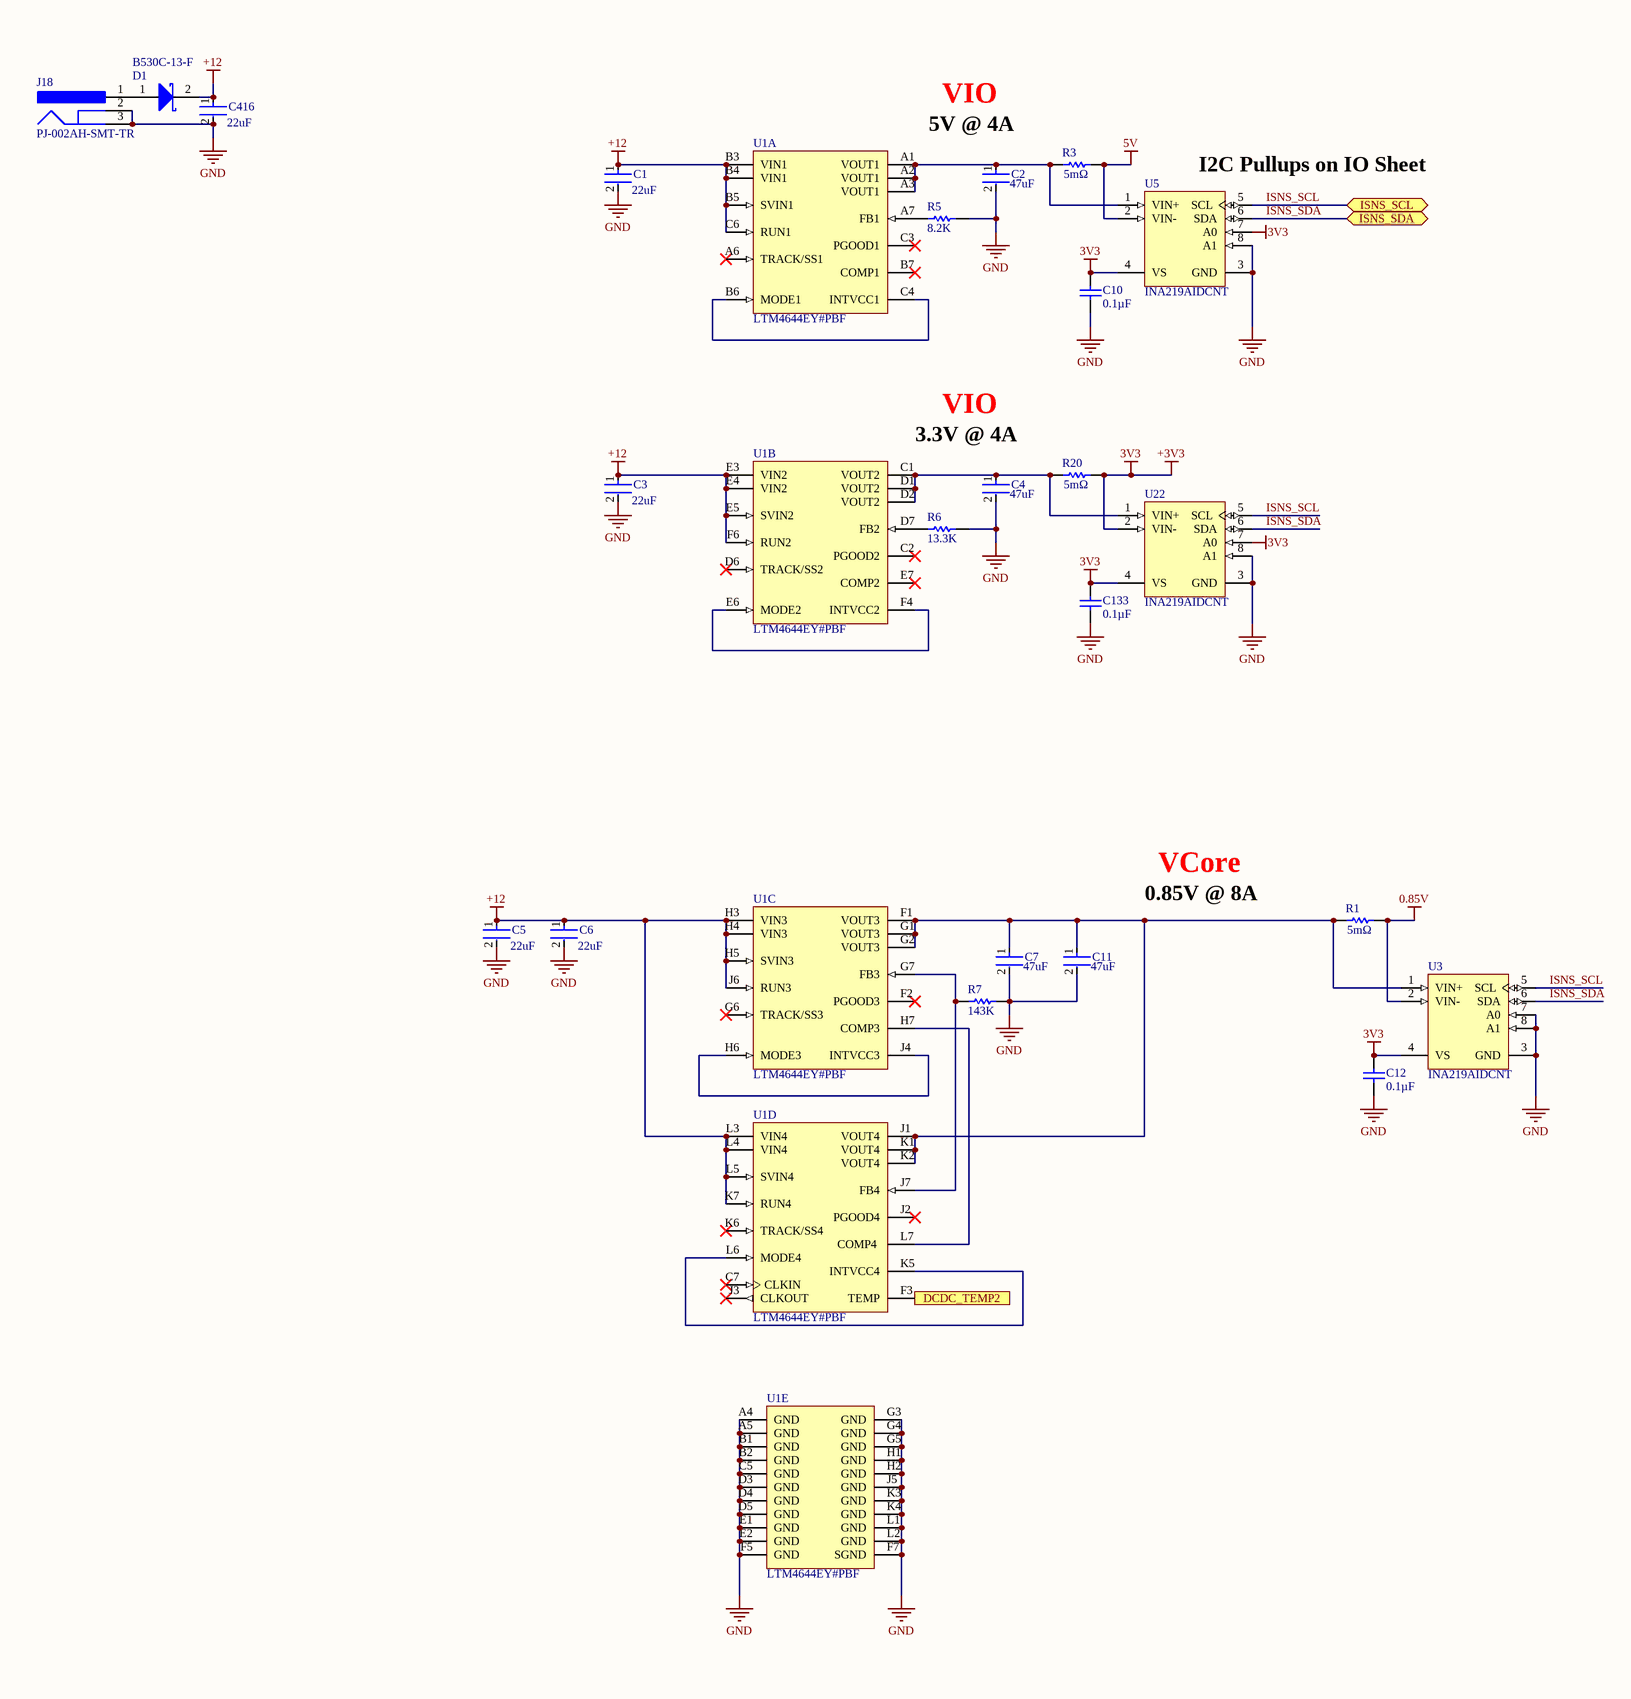
[diagram p16: Power Supplies.SchDoc, left]
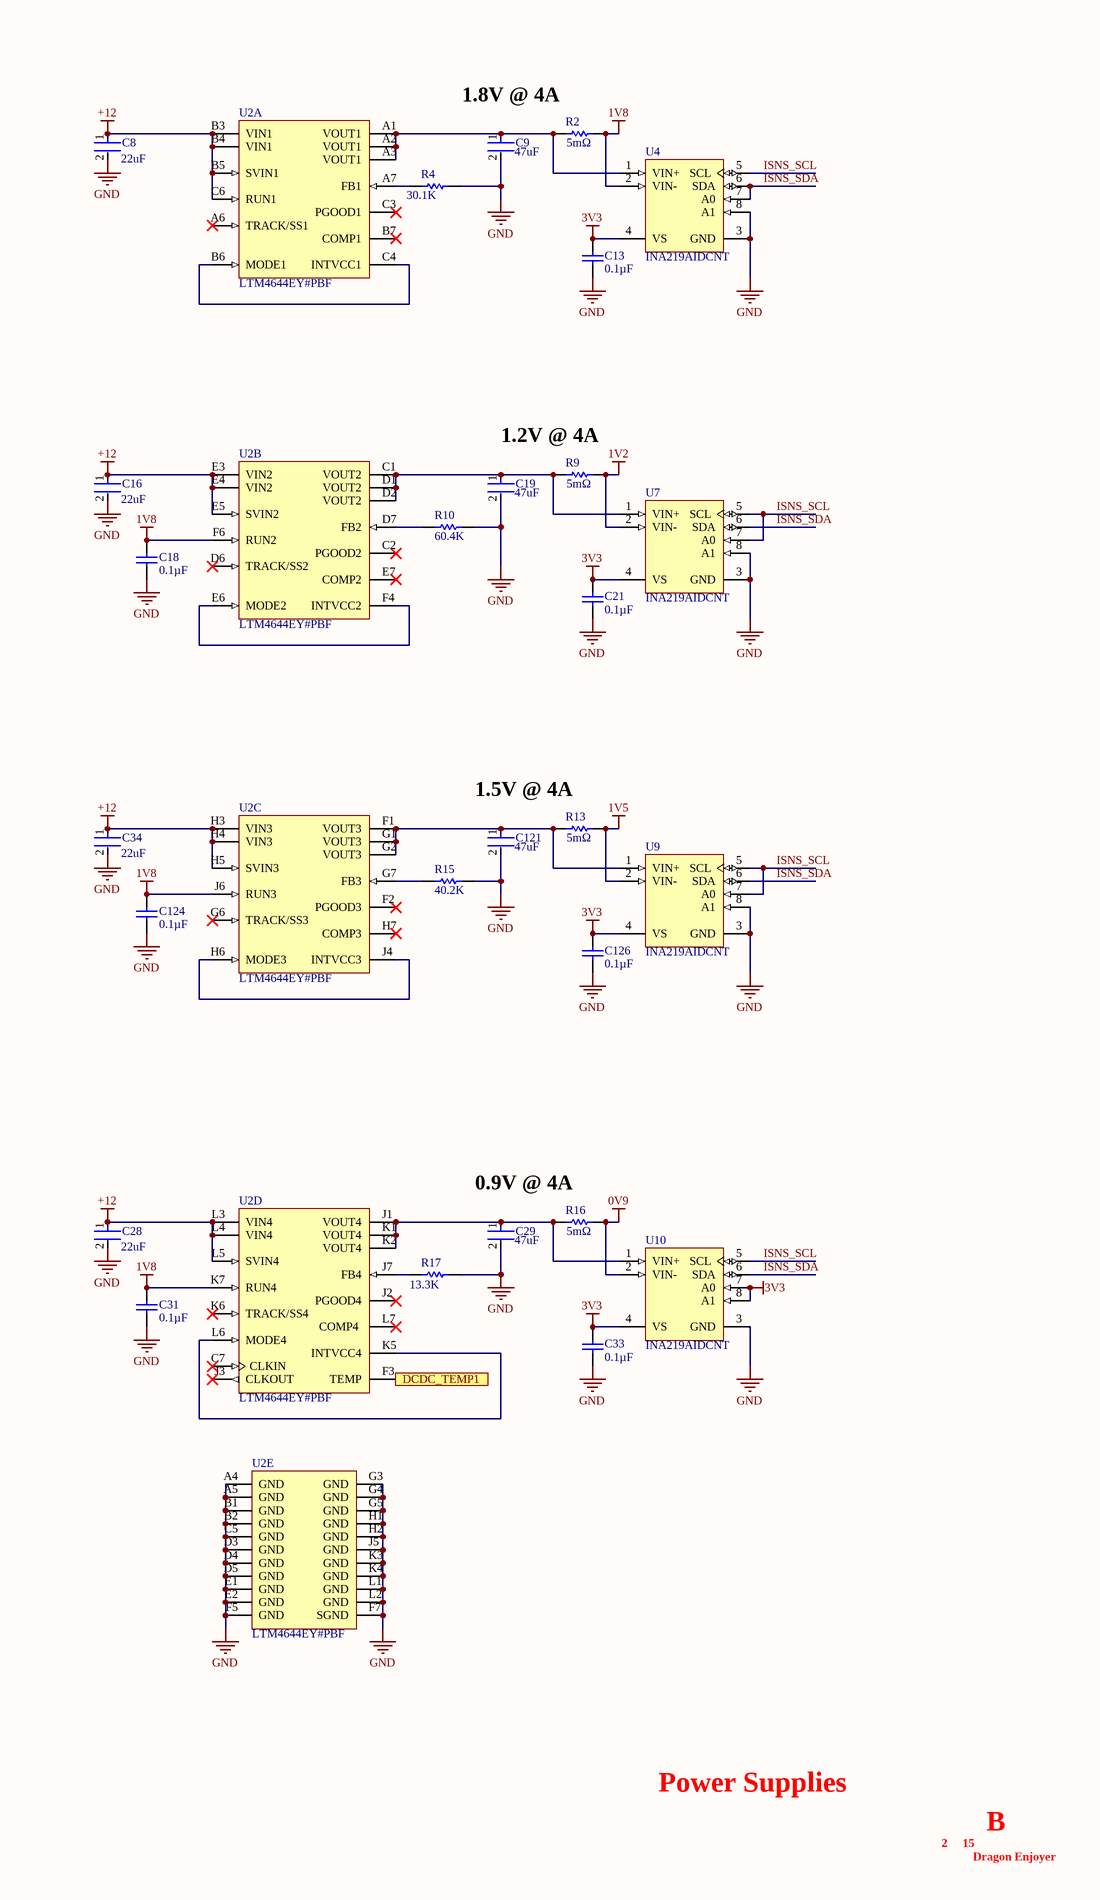
[diagram p17: Power Supplies.SchDoc, right]

### Parts
C1  value 22uF  [FP-CL31H-0_2-MFG]  (hidden comment: CL31A226KAHNNNE)
C2  Capacitance: 47uF  [FP-GRM31C-0_2-e0_3_0_8-IPC_C]  (hidden comment: GRM31CR60J476ME19L)
C3  value 22uF  [FP-CL31H-0_2-MFG]  (hidden comment: CL31A226KAHNNNE)
C4  Capacitance: 47uF  [FP-GRM31C-0_2-e0_3_0_8-IPC_C]  (hidden comment: GRM31CR60J476ME19L)
C5  value 22uF  [FP-CL31H-0_2-MFG]  (hidden comment: CL31A226KAHNNNE)
C6  value 22uF  [FP-CL31H-0_2-MFG]  (hidden comment: CL31A226KAHNNNE)
C7  Capacitance: 47uF  [FP-GRM31C-0_2-e0_3_0_8-IPC_C]  (hidden comment: GRM31CR60J476ME19L)
C8  value 22uF  [FP-CL31H-0_2-MFG]  (hidden comment: CL31A226KAHNNNE)
C9  Capacitance: 47uF  [FP-GRM31C-0_2-e0_3_0_8-IPC_C]  (hidden comment: GRM31CR60J476ME19L)
C10  Capacitance: 0.1µF  [CAPC1005X55X25LL05T05]  (hidden comment: CC0402ZRY5V8BB104)
C11  Capacitance: 47uF  [FP-GRM31C-0_2-e0_3_0_8-IPC_C]  (hidden comment: GRM31CR60J476ME19L)
C12  Capacitance: 0.1µF  [CAPC1005X55X25LL05T05]  (hidden comment: CC0402ZRY5V8BB104)
C13  Capacitance: 0.1µF  [CAPC1005X55X25LL05T05]  (hidden comment: CC0402ZRY5V8BB104)
C16  value 22uF  [FP-CL31H-0_2-MFG]  (hidden comment: CL31A226KAHNNNE)
C18  Capacitance: 0.1µF  [CAPC1005X55X25LL05T05]  (hidden comment: CC0402ZRY5V8BB104)
C19  Capacitance: 47uF  [FP-GRM31C-0_2-e0_3_0_8-IPC_C]  (hidden comment: GRM31CR60J476ME19L)
C21  Capacitance: 0.1µF  [CAPC1005X55X25LL05T05]  (hidden comment: CC0402ZRY5V8BB104)
C28  value 22uF  [FP-CL31H-0_2-MFG]  (hidden comment: CL31A226KAHNNNE)
C29  Capacitance: 47uF  [FP-GRM31C-0_2-e0_3_0_8-IPC_C]  (hidden comment: GRM31CR60J476ME19L)
C31  Capacitance: 0.1µF  [CAPC1005X55X25LL05T05]  (hidden comment: CC0402ZRY5V8BB104)
C33  Capacitance: 0.1µF  [CAPC1005X55X25LL05T05]  (hidden comment: CC0402ZRY5V8BB104)
C34  value 22uF  [FP-CL31H-0_2-MFG]  (hidden comment: CL31A226KAHNNNE)
C121  Capacitance: 47uF  [FP-GRM31C-0_2-e0_3_0_8-IPC_C]  (hidden comment: GRM31CR60J476ME19L)
C124  Capacitance: 0.1µF  [CAPC1005X55X25LL05T05]  (hidden comment: CC0402ZRY5V8BB104)
C126  Capacitance: 0.1µF  [CAPC1005X55X25LL05T05]  (hidden comment: CC0402ZRY5V8BB104)
C133  Capacitance: 0.1µF  [CAPC1005X55X25LL05T05]  (hidden comment: CC0402ZRY5V8BB104)
C416  value 22uF  [FP-CL31H-0_2-MFG]  (hidden comment: CL31A226KAHNNNE)
D1  B530C-13-F  [DIOD-SMC-2_V]
J18  PJ-002AH-SMT-TR  [CUI-PJ-002AH-4_V]
R1  value 5mΩ  [RESC3216X89X64NL25T25]  (hidden comment: WSL12065L000FEA)
R2  value 5mΩ  [RESC3216X89X64NL25T25]  (hidden comment: WSL12065L000FEA)
R3  value 5mΩ  [RESC3216X89X64NL25T25]  (hidden comment: WSL12065L000FEA)
R4  value 30.1K  [RESC1609X55X30ML10T20]  (hidden comment: TNPW060330K1BEEA)
R5  8.2K  [RESC1005X40X25ML05T05]
R6  13.3K  [RESC1005X40X25NL10T10]
R7  143K  [RESC1005X40X25LL05T05]
R9  value 5mΩ  [RESC3216X89X64NL25T25]  (hidden comment: WSL12065L000FEA)
R10  value 60.4K  [RESC1608X50X30ML20T20]  (hidden comment: RG1608P-6042-B-T1)
R13  value 5mΩ  [RESC3216X89X64NL25T25]  (hidden comment: WSL12065L000FEA)
R15  40.2K  [RESC0603(1608)_M]
R16  value 5mΩ  [RESC3216X89X64NL25T25]  (hidden comment: WSL12065L000FEA)
R17  value 13.3K  [RESC1609X55X30ML10T20]  (hidden comment: TNPW060313K3BEEA)
R20  value 5mΩ  [RESC3216X89X64NL25T25]  (hidden comment: WSL12065L000FEA)
U1  LTM4644EY#PBF  [LT-BGA-77-05-08-1900_V]  (parts A,B,C,D,E of 5)
U2  LTM4644EY#PBF  [LT-BGA-77-05-08-1900_V]  (parts A,B,C,D,E of 5)
U3  INA219AIDCNT  [DCN0008A_L]
U4  INA219AIDCNT  [DCN0008A_L]
U5  INA219AIDCNT  [DCN0008A_L]
U7  INA219AIDCNT  [DCN0008A_L]
U9  INA219AIDCNT  [DCN0008A_L]
U10  INA219AIDCNT  [DCN0008A_L]
U22  INA219AIDCNT  [DCN0008A_L]

### Ports
DCDC_TEMP1 (out), DCDC_TEMP2 (out), ISNS_SCL (bidir), ISNS_SDA (bidir)

### Nets
0.85V: R1.2 U3.2(VIN-)
0V9: R16.2 U10.2(VIN-)
1V2: R9.2 U7.2(VIN-)
1V5: R13.2 U9.2(VIN-)
1V8: C18.2 C31.2 C124.2 R2.2 U2.F6(RUN2) U2.J6(RUN3) U2.K7(RUN4) U4.2(VIN-)
5V: R3.2 U5.2(VIN-)
+3V3: C10.2 C12.2 C13.2 C21.2 C33.2 C126.2 C133.2 R20.2 U3.4(VS) U4.4(VS) U5.4(VS) U5.7(A0) U7.4(VS) U9.4(VS) U10.4(VS) U10.7(A0) U10.8(A1) U22.2(VIN-) U22.4(VS) U22.7(A0)  [also labelled 3V3]
+12: C1.1 C3.1 C5.1 C6.1 C8.1 C16.1 C28.1 C34.1 C416.1 D1.2(K) U1.B3(VIN1) U1.B4(VIN1) U1.B5(SVIN1) U1.C6(RUN1) U1.E3(VIN2) U1.E4(VIN2) U1.E5(SVIN2) U1.F6(RUN2) U1.H3(VIN3) U1.H4(VIN3) U1.H5(SVIN3) U1.J6(RUN3) U1.K7(RUN4) U1.L3(VIN4) U1.L4(VIN4) U1.L5(SVIN4) U2.B3(VIN1) U2.B4(VIN1) U2.B5(SVIN1) U2.C6(RUN1) U2.E3(VIN2) U2.E4(VIN2) U2.E5(SVIN2) U2.H3(VIN3) U2.H4(VIN3) U2.H5(SVIN3) U2.L3(VIN4) U2.L4(VIN4) U2.L5(SVIN4)
GND: C1.2 C2.2 C3.2 C4.2 C5.2 C6.2 C7.2 C8.2 C9.2 C10.1 C11.2 C12.1 C13.1 C16.2 C18.1 C19.2 C21.1 C28.2 C29.2 C31.1 C33.1 C34.2 C121.2 C124.1 C126.1 C133.1 C416.2 J18.2 J18.3 R4.2 R5.2 R6.2 R7.2 R10.1 R15.2 R17.2 U1.A4(GND) U1.A5(GND) U1.B1(GND) U1.B2(GND) U1.C5(GND) U1.D3(GND) U1.D4(GND) U1.D5(GND) U1.E1(GND) U1.E2(GND) U1.F5(GND) U1.F7(SGND) U1.G3(GND) U1.G4(GND) U1.G5(GND) U1.H1(GND) U1.H2(GND) U1.J5(GND) U1.K3(GND) U1.K4(GND) U1.L1(GND) U1.L2(GND) U2.A4(GND) U2.A5(GND) U2.B1(GND) U2.B2(GND) U2.C5(GND) U2.D3(GND) U2.D4(GND) U2.D5(GND) U2.E1(GND) U2.E2(GND) U2.F5(GND) U2.F7(SGND) U2.G3(GND) U2.G4(GND) U2.G5(GND) U2.H1(GND) U2.H2(GND) U2.J5(GND) U2.K3(GND) U2.K4(GND) U2.L1(GND) U2.L2(GND) U3.3(GND) U3.7(A0) U3.8(A1) U4.3(GND) U4.8(A1) U5.3(GND) U5.8(A1) U7.3(GND) U7.8(A1) U9.3(GND) U9.8(A1) U10.3(GND) U22.3(GND) U22.8(A1)
ISNS_SCL: U3.5(SCL) U4.5(SCL) U5.5(SCL) U7.5(SCL) U7.7(A0) U9.5(SCL) U9.7(A0) U10.5(SCL) U22.5(SCL) ; port ISNS_SCL
ISNS_SDA: U3.6(SDA) U4.6(SDA) U4.7(A0) U5.6(SDA) U7.6(SDA) U9.6(SDA) U10.6(SDA) U22.6(SDA) ; port ISNS_SDA
NetC2_1: C2.1 R3.1 U1.A1(VOUT1) U1.A2(VOUT1) U1.A3(VOUT1) U5.1(VIN+)
NetC4_1: C4.1 R20.1 U1.C1(VOUT2) U1.D1(VOUT2) U1.D2(VOUT2) U22.1(VIN+)
NetC7_1: C7.1 C11.1 R1.1 U1.F1(VOUT3) U1.G1(VOUT3) U1.G2(VOUT3) U1.J1(VOUT4) U1.K1(VOUT4) U1.K2(VOUT4) U3.1(VIN+)
NetC9_1: C9.1 R2.1 U2.A1(VOUT1) U2.A2(VOUT1) U2.A3(VOUT1) U4.1(VIN+)
NetC19_1: C19.1 R9.1 U2.C1(VOUT2) U2.D1(VOUT2) U2.D2(VOUT2) U7.1(VIN+)
NetC29_1: C29.1 R16.1 U2.J1(VOUT4) U2.K1(VOUT4) U2.K2(VOUT4) U10.1(VIN+)
NetC121_1: C121.1 R13.1 U2.F1(VOUT3) U2.G1(VOUT3) U2.G2(VOUT3) U9.1(VIN+)
NetD1_1: D1.1(A) J18.1
NetR4_1: R4.1 U2.A7(FB1)
NetR5_1: R5.1 U1.A7(FB1)
NetR6_1: R6.1 U1.D7(FB2)
NetR7_1: R7.1 U1.G7(FB3) U1.J7(FB4)
NetR10_2: R10.2 U2.D7(FB2)
NetR15_1: R15.1 U2.G7(FB3)
NetR17_1: R17.1 U2.J7(FB4)
NetU1_B6: U1.B6(MODE1) U1.C4(INTVCC1)
NetU1_E6: U1.E6(MODE2) U1.F4(INTVCC2)
NetU1_F3: U1.F3(TEMP) ; port DCDC_TEMP2
NetU1_H6: U1.H6(MODE3) U1.J4(INTVCC3)
NetU1_H7: U1.H7(COMP3) U1.L7(COMP4)
NetU1_K5: U1.K5(INTVCC4) U1.L6(MODE4)
NetU2_B6: U2.B6(MODE1) U2.C4(INTVCC1)
NetU2_E6: U2.E6(MODE2) U2.F4(INTVCC2)
NetU2_F3: U2.F3(TEMP) ; port DCDC_TEMP1
NetU2_H6: U2.H6(MODE3) U2.J4(INTVCC3)
NetU2_K5: U2.K5(INTVCC4) U2.L6(MODE4)

Not connected (* = marked no-connect by the designer): U1 A6(TRACK/SS1)* B7(COMP1)* C2(PGOOD2)* C3(PGOOD1)* C7(CLKIN)* D6(TRACK/SS2)* E7(COMP2)* F2(PGOOD3)* G6(TRACK/SS3)* J2(PGOOD4)* J3(CLKOUT)* K6(TRACK/SS4)*; U2 A6(TRACK/SS1)* B7(COMP1)* C2(PGOOD2)* C3(PGOOD1)* C7(CLKIN)* D6(TRACK/SS2)* E7(COMP2)* F2(PGOOD3)* G6(TRACK/SS3)* H7(COMP3)* J2(PGOOD4)* J3(CLKOUT)* K6(TRACK/SS4)* L7(COMP4_)*

### Notes on the sheet
- VIO
- 5V @ 4A
- (near U5) I2C Pullups on IO Sheet
- 1.8V @ 4A
- 3.3V @ 4A
- 1.2V @ 4A
- 1.5V @ 4A
- 0.85V @ 8A
- VCore
- 0.9V @ 4A
- Power Supplies
- 2
- 15
- Dragon Enjoyer
- B

### Library data of the parts
C1 C3 C5 C6 C8 C16 C28 C34 C416 = CMP-13271-000012-1: CAP CER 22UF 25V X5R 1206; Manufacturer: Samsung; Temperature Coefficient: 15%; Tolerance: 10%; Material: Ceramic; Automotive: No; Device Class L3: Ceramic Capacitors; Temperature: -55°C to +85°C; Octopart: https://octopart.com/cl31a226kahnnne-samsung-19832795; Temperature Range Low: -55°C; Voltage Rating: 25V; Height: 1.8mm; Temperature Characteristic: X5R; Package: CL31H-0.2; Temperature Range High: +85°C; ComponentLink2URL: http://www.samsungsem.com/kr/support/product-search/mlcc/__icsFiles/afieldfile/2019/05/10/19-CL31A226KAHNNNE.pdf; Ipc Land Pattern Name: CAPC320160X160; Lead Free: Yes; Device Class L2: Capacitors; Device Class L1: Passive Components; Capacitance: 22uF; Digikey Description: CAP CER 22UF 25V X5R 1206; Manufacturer Part Number: CL31A226KAHNNNE; RoHS: TRUE; Category: Cap; ComponentLink2Description: Datasheet
C2 C4 C7 C9 C11 C19 C29 C121 = CMP-2000-06344-2: Chip Multilayer Ceramic Capacitors for General Purpose, 1206, 47uF, X5R, 15%, 20%, 6.3V; Package Quantity: 2000; Mount: Surface Mount; Length: 3.2mm; Thickness: 0.071inch; Lead Free: Lead Free; Tolerance: 20%; Width: 0.063inch; Depth: 1.6mm; Case/Package: 1206; Dielectric: X5R; Radiation Hardening: No; Packaging: Tape and Reel; Voltage Rating (DC): 6.3V; Termination: SMD/SMT; Height: 1.6mm; Max Operating Temperature: 85°C; Case Code (Metric): 3216; Case Code (Imperial): 1206; Voltage: 6.3V; Voltage Rating: 6.3V; Min Operating Temperature: -55°C; Material: Ceramic; REACH SVHC: No SVHC
C10 C12 C13 C18 C21 C31 C33 C124 C126 C133 = CMP-2000-06071-1: Chip Capacitor, 100 nF, -20% to 80%, 25 V, -30 to 85 degC, 0402 (1005 Metric), RoHS, Tape and Reel; Manufacturer: Yageo; Online Catalog: CCSeries; Tolerance: -20%,+80%; Voltage - Rated: 25V; Product Training Modules: MultilayerCeramicCapacitors; Catalog Drawings: CC_0402; Other Names: 311-1375-6; Temperature Coefficient: Y5V(F); Datasheet URL: http://www.farnell.com/datasheets/1132289.pdf; Features: -; Package Description: 2-Pin Surface Mount Device, Body 1 x 0.5 mm; Standard Package: 1; Mounting Technology: SurfaceMount; Lead Style: -; Thickness (Max): 0.022"(0.55mm); Family: CeramicCapacitors; Series: CC; Applications: GeneralPurpose; Lead Spacing: -; Size / Dimension: 0.039"Lx0.020"W(1.00mmx0.50mm); Manufacturer URL: http://www.yageo.com/; Category: Capacitors; Datasheet Version: Rev. 5, 07/2010; Height - Seated (Max): -; Packaging: Digi-Reel®; Operating Temperature: -30°C~85°C; Mounting Type: SurfaceMount,MLCC; Package Reference: 0402; Ratings: -; Package / Case: 0402(1005Metric)
D1 = CMP-1693-00001-3: Surface Mount Schottky Barrier Rectifier, 5 A, 0.55 V, -55 to 150 degC, 2-Pin SMD, RoHS, Tape and Reel; Max Operating Temperature: 125 degC; ComponentLink2Description: Datasheet; PackageDescription: 2-Pin Surface Mount Device, Body 5.905 x 6.855 mm; Radiation Hardening: No; Mount: Surface Mount; Height: 2.3 mm; REACH SVHC: No SVHC; PartNumber: B530C-13-F; Packaging: Tape and Reel; Min Operating Temperature: -55 degC; Mounting Technology: Surface Mount; ComponentLink1URL: http://www.diodes.com/; ComponentLink1Description: Manufacturer URL; DatasheetVersion: Rev. 16-2; Length: 7.11 mm; ComponentLink2URL: http://www.diodes.com/_files/datasheets/ds13012.pdf; Package Quantity: 3000; Width: 6.22 mm; Case/Package: SMC; Pins: 2; RoHSCompliant: True
J18 = CMP-2000-06896-1: DC Power Jack, Right Angle, -25 to 85 degC, 4-Pin 14.8 x 9 x 11 mm SMD, RoHS, Tape and Reel; Manufacturer: CUIInc.; Current Rating: 5A; Voltage Rating: 24V; Outside Contact Diameter: 6.5mm; Inside Contact Diameter: 2mm; Insulation Resistance: 100MOhms; Brand: CUI; Contact Plating: Nickel; Contact Gender: Male; Datasheet URL: http://www.cui.com/product/resource/pj-002ah-smt.pdf; Mounting Style: SMD/SMT; Mounting Technology: SurfaceMount; Operating Temperature Range: -25Cto+85C; Flammability Rating: UL94V-0; Mounting Angle: Right; Packaging: Reel; Connector Type: DCPowerJack; Product Category: DCPowerConnectors; Package Description: 4-Pin Surface Mount Device, Body 14.8 x 9 mm, Pitch 6.1 mm; Factory Pack Quantity: 350; Datasheet Version: Rev. 1.03, 11/2012; Contact Material: Brass; Package Reference: PJ-002AH; Housing Material: Polyamide(PA); PartNumber: PJ-002AH; Manufacturer URL: http://www.cui.com/; Product: Jacks; RoHS: True; Termination Style: SMD/SMT
R1-R3 R9 R13 R16 R20 = CMP-2003-04336-1: Manufacturer: Vishay Dale; Part Number: WSL12065L000FEA
R4 = CMP-2000-03757-1: Manufacturer: Vishay Dale; Part Number: TNPW060330K1BEEA
R5 = CMP-2002-00254-1: Part Number: CRCW04028K20FKED; Manufacturer: Vishay Dale
R6 = CMP-2002-05937-1: Manufacturer: Multicomp; Part Number: MC00625W0402113K3
R7 = CMP-1011-00752-2: Part Number: ERJ-2RKF1433X; Manufacturer: Panasonic
R10 = CMP-2000-02320-1: Manufacturer: Susumu; Part Number: RG1608P-6042-B-T1
R15 = CMP-1012-00691-1: 40K2 0.1W 1% 0603 (1608 Metric)  SMD; Case-Metric: 1608; Value: 40200.00 Ohm; Case-EIA: 0603; Tolerance: 1 %; Technology: SMT; Power: 0.1 W
R17 = CMP-2000-03706-1: Manufacturer: Vishay Dale; Part Number: TNPW060313K3BEEA
U1 U2 = CMP-0492-02658-1: Quad DC/DC uModule Regulator, 4 A, 4 to 14 V, -40 to 125 degC, 77-Pin BGA, RoHS, Tray; Manufacturer: Linear Technology; fOSC: 1 MHz Typ.; IS(VIN): 0.62 A Typ.; VOUT(DC): 1.477 to 1.523 V; VRUN: 1.1 to 1.3 V; VIN: 4 to 14 V; CLKIN: 0.7 V Typ.; IOUT(DC): 0 to 4 A; ComponentLink1URL: http://www.linear.com/; PartNumber: LTM4644EY#PBF; DatasheetVersion: Rev. B; Mounting Technology: Surface Mount; PackageDescription: 77-Pin Ball Grid Array, Body 15 x 9 mm, Pitch 1.27 mm; ComponentLink2Description: Datasheet; ComponentLink1Description: Manufacturer URL; ComponentLink3URL: http://cds.linear.com/docs/en/packaging/05081900_D_bga77.pdf; Packing: Tray; RoHS: TRUE; ComponentLink3Description: Package Specification; PackageVersion: Rev. D; Operating Temperature Range: -40 to 125 degC; ComponentLink2URL: http://cds.linear.com/docs/en/datasheet/4644fb.pdf
U3-U5 U7 U9 U10 U22 = CMP-0704-00039-2: Zero-Drift, Bi-Directional Current / Power Monitor, 3 to 5.5 V, -40 to 125 degC, 8-pin SOT23 (DCN8), Green (RoHS & no Sb/Br); Manufacturer: Texas Instruments; Input Offset (+/-)(Max)(uV): 100; Common Mode Range(Max)(V): 26; Gain(V/V): 1, 0.5, 0.25, 0.125; Vs(Min)(V): 3; Vs(Max)(V): 5.5; Small-Signal Bandwidth(Typ)(MHz): 0.011; Rating: Catalog; SubFamily: Current Shunt Monitor; Common Mode Range(Min)(V): 0; Quiescent Current (+/-)(Typ)(mA): 0.7; Code_JEDEC: MO-178; DatasheetVersion: SBOS448F; ComponentLink3URL: http://www.ti.com/lit/ml/mpds099c/mpds099c.pdf; PackageReference: DCN0008A; Eco-Plan: Green (RoHS & no Sb/Br); PackageVersion: 4202106/D, 11/2009; PackageDescription: 8-Pin Plastic Small Outline, Body 1.6 x 2.9 mm, Pitch 0.65 mm; ComponentLink3Description: Package Specification; ComponentLink1Description: Manufacturer URL; ComponentLink1URL: http://www.ti.com/; CMRR(Min)(dB): 100; Mounting Technology: Surface Mount; ComponentLink2URL: http://www.ti.com/general/docs/lit/getliterature.tsp?genericPartNumber=INA219&fileType=pdf; PartNumber: INA219AIDCNT; ComponentLink2Description: Datasheet

## Sheet Switches.SchDoc
size A4; SheetNumber: 14; SheetTotal: 16
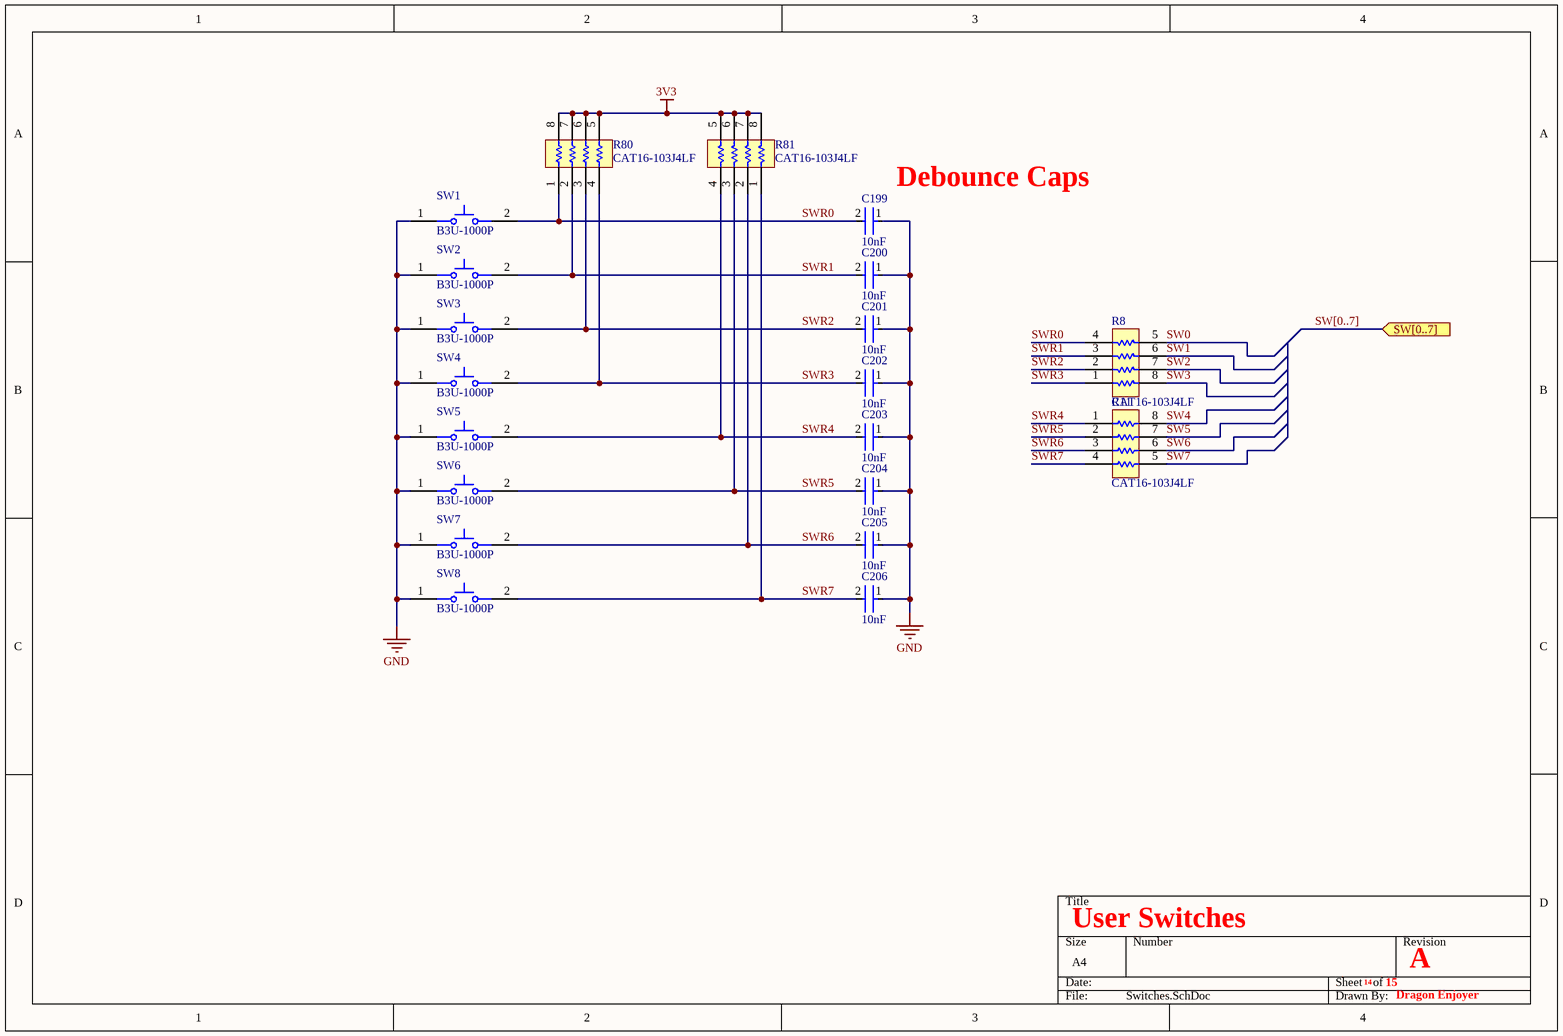
[diagram p18: Switches.SchDoc]

### Parts
C199  Capacitance: 10nF  [FP-GRM155-0_05-IPC_C]  (hidden comment: GRM155R71H103KA88D)
C200  Capacitance: 10nF  [FP-GRM155-0_05-IPC_C]  (hidden comment: GRM155R71H103KA88D)
C201  Capacitance: 10nF  [FP-GRM155-0_05-IPC_C]  (hidden comment: GRM155R71H103KA88D)
C202  Capacitance: 10nF  [FP-GRM155-0_05-IPC_C]  (hidden comment: GRM155R71H103KA88D)
C203  Capacitance: 10nF  [FP-GRM155-0_05-IPC_C]  (hidden comment: GRM155R71H103KA88D)
C204  Capacitance: 10nF  [FP-GRM155-0_05-IPC_C]  (hidden comment: GRM155R71H103KA88D)
C205  Capacitance: 10nF  [FP-GRM155-0_05-IPC_C]  (hidden comment: GRM155R71H103KA88D)
C206  Capacitance: 10nF  [FP-GRM155-0_05-IPC_C]  (hidden comment: GRM155R71H103KA88D)
R8  CAT16-103J4LF  [BOUR-CAT16-103J4LF_L]
R11  CAT16-103J4LF  [BOUR-CAT16-103J4LF_L]
R80  CAT16-103J4LF  [BOUR-CAT16-103J4LF_L]
R81  CAT16-103J4LF  [BOUR-CAT16-103J4LF_L]
SW1  B3U-1000P  [OMRON-B3U-1000_V]
SW2  B3U-1000P  [OMRON-B3U-1000_V]
SW3  B3U-1000P  [OMRON-B3U-1000_V]
SW4  B3U-1000P  [OMRON-B3U-1000_V]
SW5  B3U-1000P  [OMRON-B3U-1000_V]
SW6  B3U-1000P  [OMRON-B3U-1000_V]
SW7  B3U-1000P  [OMRON-B3U-1000_V]
SW8  B3U-1000P  [OMRON-B3U-1000_V]

### Ports
SW[0..7] (in)

### Nets
3V3: R80.5 R80.6 R80.7 R80.8 R81.5 R81.6 R81.7 R81.8  [project net +3V3]
GND: C199.1 C200.1 C201.1 C202.1 C203.1 C204.1 C205.1 C206.1 SW1.1 SW2.1 SW3.1 SW4.1 SW5.1 SW6.1 SW7.1 SW8.1
SW0: R8.5
SW1: R8.6
SW2: R8.7
SW3: R8.8
SW4: R11.8
SW5: R11.7
SW6: R11.6
SW7: R11.5
SWR0: C199.2 R8.4 R80.1 SW1.2
SWR1: C200.2 R8.3 R80.2 SW2.2
SWR2: C201.2 R8.2 R80.3 SW3.2
SWR3: C202.2 R8.1 R80.4 SW4.2
SWR4: C203.2 R11.1 R81.4 SW5.2
SWR5: C204.2 R11.2 R81.3 SW6.2
SWR6: C205.2 R11.3 R81.2 SW7.2
SWR7: C206.2 R11.4 R81.1 SW8.2

### Buses and harness runs
bus SW[0..7] = port SW[0..7]

### Notes on the sheet
- (near C199) Debounce Caps
- User Switches
- 14
- 15
- A
- Dragon Enjoyer

### Library data of the parts
C199-C206 = CMP-2008-04637-5: as C190 on sheet FPGA Transcievers; Tolerance: 10%; Mount: Surface Mount; Lead Free: Lead Free; Radiation Hardening: No; Case Code (Imperial): 0402; REACH SVHC: No SVHC; Case/Package: 0402; Dielectric: X7R; Voltage Rating (DC): 50V; Max Operating Temperature: 125°C; Termination: SMD/SMT; Material: Ceramic; Width: 0.02inch; Package Quantity: 1; Voltage Rating: 50V; Thickness: 0.022inch; Packaging: Tape and Reel; Height: 0.5mm; Number of Pins: 2; Case Code (Metric): 1005; Min Operating Temperature: -55°C; Length: 1mm; Depth: 0.5mm
R8 R11 R80 R81 = CMP-2000-06067-1: CAT / CAY 16 Series - Chip Resistor Array, 10 KOhm, +/- 5%, 50 V, -55 to 125 degC, 8-Pin SMD, RoHS, Tape and Reel; Manufacturer: Bourns; Power Per Element: 62.5mW; Online Catalog: CAT16Series; Resistance (Ohms): 10k; Number of Resistors: 4; EDA / CAD Models: DownloadfromAcceleratedDesigns; Temperature Coefficient: ±200ppm/°C; Circuit Type: Isolated; Other Names: CAT16-103J4LFDKR; Package Reference: CAT16-103J4LF; Datasheet Version: 09/2014; Series: CAT16; Manufacturer URL: http://www.bourns.com/; Mounting Type: SurfaceMount; Datasheet URL: http://www.mouser.com/ds/2/54/ATCAY-777361.pdf; Category: Resistors; Height: 0.024"(0.60mm); Mounting Technology: SurfaceMount; Applications: -; Size / Dimension: 0.126"Lx0.061"W(3.20mmx1.55mm); Packaging: Digi-Reel®; Package / Case: 1206(3216Metric),Concave,LongSideTerminals; Supplier Device Package: 1206; RoHS Information: CAT16MaterialDeclaration; Number of Pins: 8; Family: ResistorNetworks,Arrays; Standard Package: 1; Package Description: 8-Pin Surface Mount Device, Body 3.2 x 1.55 mm, Pitch 0.8 mm; Operating Temperature: -55°C~125°C; Tolerance: ±5%
SW1-SW8 = CMP-011-00000-1: Tactile Switch, SPST-NO, 0.05 A, 12 V, -25 to 70 degC, 2-Pin SMD, RoHS, Tape and Reel; Manufacturer: Omron Electronic Components; Contact Current Rating: 50mA; Max Voltage Rating (DC): 12V; Resistance: 0.1Ohm; Max Contact Resistance: 100mohm; Throw Configuration: SPST; Operating Force: 153gf; IP Rating: IP40; Min Operating Temperature: -25°C; RoHS Compliant: True; Package Description: 2-Pin Surface Mount Device, Body 3 x 2.5 mm; Packaging: TapeandReel; Package Reference: B3U-1000; Datasheet URL: http://www.omron.com/ecb/products/pdf/en-b3u.pdf; Contact Material: Silver; Max Current Rating: 50mA; Max Operating Temperature: 70°C; Voltage Rating: 12V; Voltage Rating (DC): 12V; Datasheet Version: Jan-15; Manufacturer URL: http://www.omron.com/; Current Rating: 50mA; Case/Package: B3U-1000; Package Quantity: 3500; Mounting Technology: SM

## Sheet TempMonADC.SchDoc
size A4; SheetNumber: 15; SheetTotal: 16
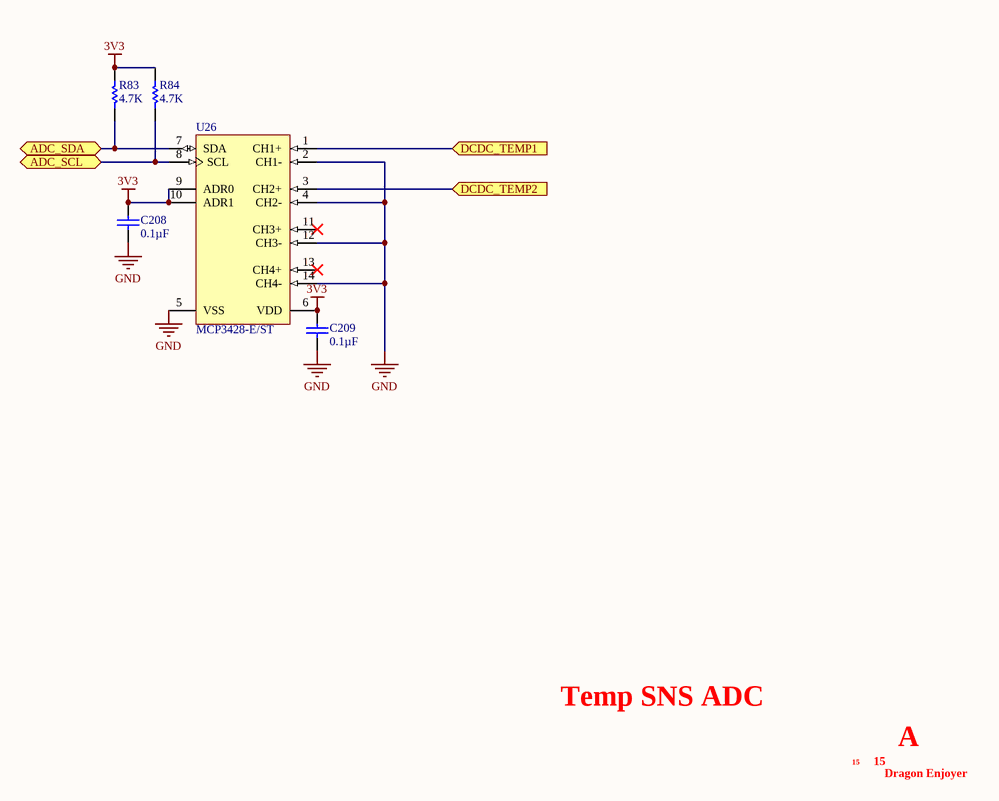
[diagram p19: TempMonADC.SchDoc]

### Parts
C208  Capacitance: 0.1µF  [CAPC1005X55X25LL05T05]  (hidden comment: CC0402ZRY5V8BB104)
C209  Capacitance: 0.1µF  [CAPC1005X55X25LL05T05]  (hidden comment: CC0402ZRY5V8BB104)
R83  value 4.7K  [RESC1005X40X25LL05T10]  (hidden comment: RC0402JR-074K7L)
R84  value 4.7K  [RESC1005X40X25LL05T10]  (hidden comment: RC0402JR-074K7L)
U26  MCP3428-E/ST  [TSSOP-ST14_L]

### Ports
ADC_SCL (bidir), ADC_SDA (bidir), DCDC_TEMP1 (in), DCDC_TEMP2 (in)

### Nets
3V3: C208.2 C209.2 R83.1 R84.1 U26.6(VDD) U26.9(ADR0) U26.10(ADR1)  [project net +3V3]
GND: C208.1 C209.1 U26.2(CH1-) U26.4(CH2-) U26.5(VSS) U26.12(CH3-) U26.14(CH4-)
NetR83_2: R83.2 U26.7(SDA) ; port ADC_SDA
NetR84_2: R84.2 U26.8(SCL) ; port ADC_SCL
NetU1_F3: U26.3(CH2+) ; port DCDC_TEMP2
NetU2_F3: U26.1(CH1+) ; port DCDC_TEMP1

Not connected (* = marked no-connect by the designer): U26 11(CH3+)* 13(CH4+)*

### Notes on the sheet
- Temp SNS ADC
- 15
- A
- Dragon Enjoyer

### Library data of the parts
C208 C209 = CMP-2000-06071-1: as C10 on sheet Power Supplies; Datasheet URL: http://www.farnell.com/datasheets/1132289.pdf; Features: -; Package Description: 2-Pin Surface Mount Device, Body 1 x 0.5 mm; Standard Package: 1; Mounting Technology: SurfaceMount; Lead Style: -; Thickness (Max): 0.022"(0.55mm); Family: CeramicCapacitors; Series: CC; Applications: GeneralPurpose; Lead Spacing: -; Size / Dimension: 0.039"Lx0.020"W(1.00mmx0.50mm); Manufacturer URL: http://www.yageo.com/; Category: Capacitors; Datasheet Version: Rev. 5, 07/2010; Height - Seated (Max): -; Packaging: Digi-Reel®; Operating Temperature: -30°C~85°C; Mounting Type: SurfaceMount,MLCC; Package Reference: 0402; Ratings: -; Package / Case: 0402(1005Metric)
R83 R84 = CMP-2002-08011-1: Manufacturer: Yageo / Phycomp; Part Number: RC0402JR-074K7L
U26 = CMP-0188-01312-1: 16-Bit, Multi-Channel Delta-Sigma Analog-to-Digital Converter with I2C Interface and On-Board Reference, 14-Pin TSSOP, Extended Temperature; PackageVersion: revBB, Aug-2009; ComponentLink2URL: http://ww1.microchip.com/downloads/en/DeviceDoc/22226a.pdf; PackageReference: TSSOP-ST14; ComponentLink1Description: Manufacturer URL; PackageDescription: 14-Lead Plastic Thin Shrink Small Outline (ST) - 4.4mm Body [TSSOP]; ComponentLink1URL: http://www.microchip.com/; ComponentLink3Description: Package Specification; ComponentLink3URL: http://www.microchip.com/stellent/groups/techpub_sg/documents/packagingspec/en012702.pdf; DatasheetVersion: revA, Dec-2009; ComponentLink2Description: Datasheet